# EAGLE schematic BeagleBone_Blue (EAGLE 8.0.1)

## Sheet 1 of 5
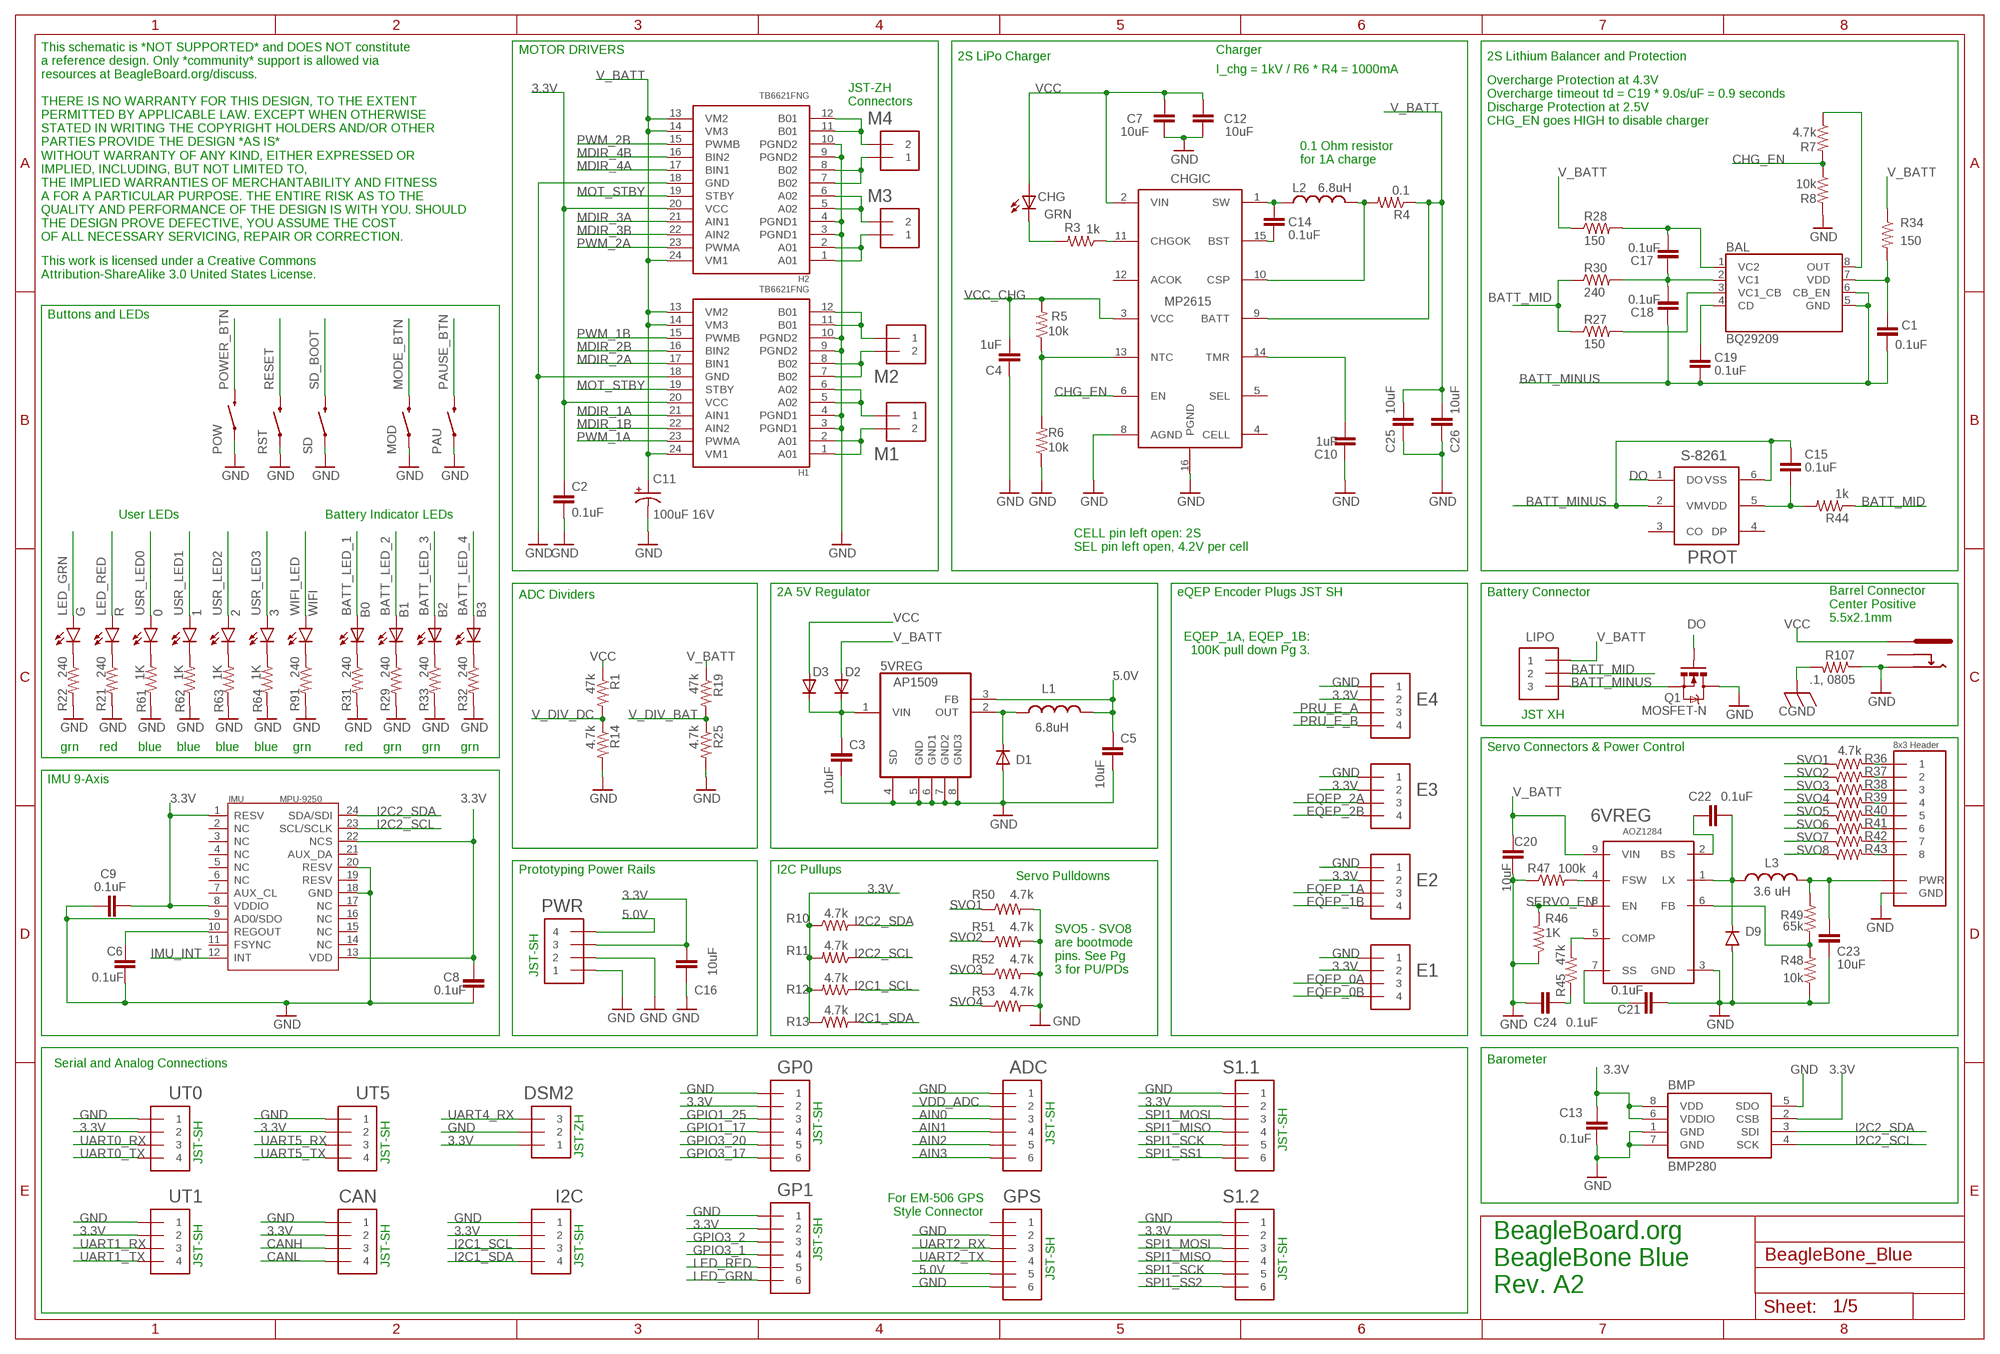
[diagram p0: schematic, sheet 1]

### Parts
0  BLUE  LED0603  [BEAGLEBONE_BLUE_LED-0603]
1  BLUE  LED0603  [BEAGLEBONE_BLUE_LED-0603]
2  BLUE  LED0603  [BEAGLEBONE_BLUE_LED-0603]
3  BLUE  LED0603  [BEAGLEBONE_BLUE_LED-0603]
5VREG  AP1509SOIC-8-TIGHT  [BEAGLEBONE_BLUE_SO08-TIGHT]
6VREG  AOZ1284  [SO08-EXPOSED]
12V  PJ-102B_POWER_CON  [PJ-102B_POWER_CON]
ADC  JST_SH_6  [JST_SH_6]
B0  RED  LED0603  [LED-0603]
B1  GREEN  LED0603  [LED-0603]
B2  GREEN  LED0603  [LED-0603]
B3  GREEN  LED0603  [LED-0603]
BAL  BQ29209  [8-SON_3X3MM]
BMP  BMP280  [BMP280]
C1  0.1uF  CAP0402-CAP  [0402-CAP]
C2  0.1uF  CAP0402-CAP  [0402-CAP]
C3  10uF  CAP0805  [0805]
C4  1uF  CAP0402-CAP  [0402-CAP]
C5  10uF  CAP0805  [0805]
C6  0.1uF  CAP0402-CAP  [0402-CAP]
C7  10uF  CAP0805  [0805]
C8  0.1uF  CAP0402-CAP  [0402-CAP]
C9  0.1uF  CAP0402-CAP  [0402-CAP]
C10  1uF  CAP0402-CAP  [0402-CAP]
C11  100uF 16V  CPOL-USD  [PANASONIC_D]
C12  10uF  CAP0805  [0805]
C13  0.1uF  CAP0402-CAP  [0402-CAP]
C14  0.1uF  CAP0402-CAP  [0402-CAP]
C15  0.1uF  CAP0402-CAP  [0402-CAP]
C16  10uF  CAP0805  [0805]
C17  0.1uF  CAP0402-CAP  [0402-CAP]
C18  0.1uF  CAP0402-CAP  [0402-CAP]
C19  0.1uF  CAP0402-CAP  [0402-CAP]
C20  10uF  CAP0805  [0805]
C21  0.1uF  CAP0402-CAP  [0402-CAP]
C22  0.1uF  CAP0402-CAP  [0402-CAP]
C23  10uF  CAP0805  [0805]
C24  0.1uF  CAP0402-CAP  [0402-CAP]
C25  10uF  CAP0805  [0805]
C26  10uF  CAP0805  [0805]
CAN  JST_SH_4  [JST_SH_4_SMD]
CHG  GRN  LED0603  [LED-0603]
CHGIC  MP2615  [MP2615]
D1  DIODE_SOD-123FL  [ADAFRUIT_SOD-123FL]
D2  DIODE_SOD-123FL  [ADAFRUIT_SOD-123FL]
D3  DIODE_SOD-123FL  [ADAFRUIT_SOD-123FL]
D9  DIODEDO214AA  [DO-214AA]
DSM2  JST_ZH_3  [JST_ZH_3]
E1  JST_SH_4  [JST_SH_4_SMD]
E2  JST_SH_4  [JST_SH_4_SMD]
E3  JST_SH_4  [JST_SH_4_SMD]
E4  JST_SH_4  [JST_SH_4_SMD]
G  GREEN  LED0603  [BEAGLEBONE_BLUE_LED-0603]
GP0  JST_SH_6  [JST_SH_6]
GP1  JST_SH_6  [JST_SH_6]
GPS  JST_SH_6  [JST_SH_6]
H1  TB6621FNG  [SSOP24]
H2  TB6621FNG  [SSOP24]
I2C  JST_SH_4  [JST_SH_4_SMD]
IMU  MPU-9250  [QFN24G-0.4-3X3MM]
J2  STRAWSON_EAGLE_LIB_SERVO_HEADERS_8X  [STRAWSON_EAGLE_LIB_3X8_0.1"_HEADER]
L1  6.8uH  INDUCTORBOURNS_SRN6045  [SRN6045]
L2  6.8uH  INDUCTORBOURNS_SRN6045  [SRN6045]
L3  3.6 uH  INDUCTOR  [8X8MM_INDUCTOR]
LIPO  BATTERY  JST_XH_3-PIN  [JST_XH_3-PIN]
M1  JST_ZH_2  [JST_ZH_2]
M2  JST_ZH_2  [JST_ZH_2]
M3  JST_ZH_2  [JST_ZH_2]
M4  JST_ZH_2  [JST_ZH_2]
MOD  SWITCH-MOMENTARY-2SMD-1101NE  [TACTILE-SWITCH-1101NE]
PAU  SWITCH-MOMENTARY-2SMD-1101NE  [TACTILE-SWITCH-1101NE]
POW  SWITCH-MOMENTARY-2SMD-1101NE  [TACTILE-SWITCH-1101NE]
PROT  S-8261  [SOT-236]
PWR  JST_SH_4  [JST_SH_4_SMD]
Q1  MOSFET-N  MOSFET-NCHANNEL  [SO08-TIGHT]
R  RED  LED0603  [BEAGLEBONE_BLUE_LED-0603]
R1  47k  RESISTOR0402-RES  [0402-RES]
R3  1k  RESISTOR0402-RES  [0402-RES]
R4  0.1  RESISTOR0603  [0603-RES]
R5  10k  RESISTOR0402-RES  [0402-RES]
R6  10k  RESISTOR0402-RES  [0402-RES]
R7  4.7k  RESISTOR0402-RES  [0402-RES]
R8  10k  RESISTOR0402-RES  [0402-RES]
R10  4.7k  RESISTOR0402-RES  [0402-RES]
R11  4.7k  RESISTOR0402-RES  [0402-RES]
R12  4.7k  RESISTOR0402-RES  [0402-RES]
R13  4.7k  RESISTOR0402-RES  [0402-RES]
R14  4.7k  RESISTOR0402-RES  [0402-RES]
R19  47k  RESISTOR0402-RES  [0402-RES]
R21  240  RESISTOR0402-RES  [0402-RES]
R22  240  RESISTOR0402-RES  [0402-RES]
R25  4.7k  RESISTOR0402-RES  [0402-RES]
R27  150  RESISTOR0402-RES  [0402-RES]
R28  150  RESISTOR0402-RES  [0402-RES]
R29  240  RESISTOR0402-RES  [0402-RES]
R30  240  RESISTOR0402-RES  [0402-RES]
R31  240  RESISTOR0402-RES  [0402-RES]
R32  240  RESISTOR0402-RES  [0402-RES]
R33  240  RESISTOR0402-RES  [0402-RES]
R34  150  RESISTOR0402-RES  [0402-RES]
R36  4.7k  RESISTOR0402-RES  [0402-RES]
R37  4.7k  RESISTOR0402-RES  [0402-RES]
R38  4.7k  RESISTOR0402-RES  [0402-RES]
R39  4.7k  RESISTOR0402-RES  [0402-RES]
R40  4.7k  RESISTOR0402-RES  [0402-RES]
R41  4.7k  RESISTOR0402-RES  [0402-RES]
R42  4.7k  RESISTOR0402-RES  [0402-RES]
R43  4.7k  RESISTOR0402-RES  [0402-RES]
R44  1k  RESISTOR0402-RES  [0402-RES]
R45  47k  RESISTOR0402-RES  [0402-RES]
R46  1K  RESISTOR0402-RES  [0402-RES]
R47  100k  RESISTOR0402-RES  [0402-RES]
R48  10k  RESISTOR0402-RES  [0402-RES]
R49  65k  RESISTOR0402-RES  [0402-RES]
R50  4.7k  RESISTOR0402-RES  [0402-RES]
R51  4.7k  RESISTOR0402-RES  [0402-RES]
R52  4.7k  RESISTOR0402-RES  [0402-RES]
R53  4.7k  RESISTOR0402-RES  [0402-RES]
R61  1K  RESISTOR0402-RES  [0402-RES]
R62  1K  RESISTOR0402-RES  [0402-RES]
R63  1K  RESISTOR0402-RES  [0402-RES]
R64  1K  RESISTOR0402-RES  [0402-RES]
R91  240  RESISTOR0402-RES  [0402-RES]
R107  .1, 0805  R-US_R0805  [R0805]
RST  SWITCH-MOMENTARY-2SMD-1101NE  [TACTILE-SWITCH-1101NE]
S1.1  JST_SH_6  [JST_SH_6]
S1.2  JST_SH_6  [JST_SH_6]
SD  SWITCH-MOMENTARY-2SMD-1101NE  [TACTILE-SWITCH-1101NE]
UT0  JST_SH_4  [JST_SH_4_SMD]
UT1  JST_SH_4  [JST_SH_4_SMD]
UT5  JST_SH_4  [JST_SH_4_SMD]
WIFI  GREEN  LED0603  [BEAGLEBONE_BLUE_LED-0603]

### Nets
3.3V: BMP.2(CSB) BMP.6(VDDIO) BMP.8(VDD) C2.2 C8.1 C9.2 C13.1 C16.1 CAN.2 DSM2.P$1 E1.2 E2.2 E3.2 E4.2 GP0.2 GP1.2 H1.20(VCC) H2.20(VCC) I2C.2 IMU.1(RESV) IMU.8(VDDIO) IMU.13(VDD) IMU.22(NCS) PWR.3 R10.1 R11.2 R12.2 R13.1 S1.1.2 S1.2.2 UT0.2 UT1.2 UT5.2 ; also sheet 2,3,5
5.0V [power]: 5VREG.3(FB) C5.1 GPS.5 L1.2 PWR.4 ; also sheet 2,3
AIN0: ADC.3 ; also sheet 3
AIN1: ADC.4 ; also sheet 3
AIN2: ADC.5 ; also sheet 3
AIN3: ADC.6 ; also sheet 3
BATT_LED_1: B0.A ; also sheet 2
BATT_LED_2: B1.A ; also sheet 3
BATT_LED_3: B2.A ; also sheet 2
BATT_LED_4: B3.A ; also sheet 2
BATT_MID: LIPO.P$2 R27.1 R30.1 R44.1
BATT_MINUS: BAL.5(GND) BAL.6(CB_EN) C1.2 C15.1 C18.1 C19.2 LIPO.P$3 PROT.2(VM) PROT.6(VSS) Q1.1(S) Q1.2(S) Q1.3(S)
CANH: CAN.3 ; also sheet 2
CANL: CAN.4 ; also sheet 2
CGND: R107.2 ; also sheet 2,3,4
CHG_EN: CHGIC.6(EN) R7.2 R8.1
CO: BAL.8(OUT) R7.1
DO: PROT.1(DO) Q1.4(G)
EQEP_0A: E1.3 ; also sheet 2
EQEP_0B: E1.4 ; also sheet 2
EQEP_1A: E2.3 ; also sheet 3
EQEP_1B: E2.4 ; also sheet 3
EQEP_2A: E3.3 ; also sheet 2
EQEP_2B: E3.4 ; also sheet 2
GND [ground]: 5VREG.4(SD) 5VREG.5(GND) 5VREG.6(GND1) 5VREG.7(GND2) 5VREG.8(GND3) 6VREG.3(GND) 12V.OUT ADC.1 BMP.1(GND) BMP.5(SDO) BMP.7(GND) C2.1 C3.2 C4.1 C5.2 C6.2 C7.2 C8.2 C9.1 C10.1 C11.- C12.2 C13.2 C16.2 C20.1 C21.1 C23.1 C24.1 C25.2 C26.2 CAN.1 CHGIC.8(AGND) CHGIC.16(PGND) D1.A D9.A DSM2.P$2 E1.1 E2.1 E3.1 E4.1 GP0.1 GP1.1 GPS.2 GPS.6 H1.3(PGND1) H1.4(PGND1) H1.9(PGND2) H1.10(PGND2) H1.18(GND) H2.3(PGND1) H2.4(PGND1) H2.9(PGND2) H2.10(PGND2) H2.18(GND) I2C.1 IMU.9(AD0/SDO) IMU.18(GND) IMU.20(RESV) J2.P$13(GND) J2.P$14(GND) J2.P$15(GND) J2.P$16(GND) J2.P$17(GND) J2.P$18(GND) J2.P$23(GND) J2.P$24(GND) MOD.1 PAU.1 POW.1 PWR.1 PWR.2 Q1.5(D) Q1.6(D) Q1.7(D) Q1.8(D) R6.1 R8.2 R14.2 R21.2 R22.2 R25.2 R29.2 R31.2 R32.2 R33.2 R46.1 R47.1 R48.1 R50.2 R51.2 R52.2 R53.2 R61.1 R62.1 R63.1 R64.1 R91.2 R107.1 RST.1 S1.1.1 S1.2.1 SD.1 UT0.1 UT1.1 UT5.1 ; also sheet 2,3,4,5
GPIO1_17: GP0.4 ; also sheet 2
GPIO1_25: GP0.3 ; also sheet 3
GPIO3_1: GP1.4 ; also sheet 3
GPIO3_2: GP1.3 ; also sheet 3
GPIO3_17: GP0.6 ; also sheet 2
GPIO3_20: GP0.5 ; also sheet 2
I2C1_SCL: I2C.3 R12.1 ; also sheet 2
I2C1_SDA: I2C.4 R13.2 ; also sheet 2
I2C2_SCL: BMP.4(SCK) IMU.23(SCL/SCLK) R11.1 ; also sheet 2
I2C2_SDA: BMP.3(SDI) IMU.24(SDA/SDI) R10.2 ; also sheet 2
IMU_INT: IMU.12(INT) ; also sheet 2
L3: B2.C R33.1
L4: B3.C R32.1
LED_GRN: G.A GP1.6 ; also sheet 2
LED_RED: GP1.5 R.A ; also sheet 2
MDIR_1A: H1.21(AIN1) ; also sheet 2
MDIR_1B: H1.22(AIN2) ; also sheet 2
MDIR_2A: H1.17(BIN1) ; also sheet 2
MDIR_2B: H1.16(BIN2) ; also sheet 3
MDIR_3A: H2.21(AIN1) ; also sheet 3
MDIR_3B: H2.22(AIN2) ; also sheet 3
MDIR_4A: H2.17(BIN1) ; also sheet 3
MDIR_4B: H2.16(BIN2) ; also sheet 3
MODE_BTN: MOD.2 ; also sheet 2
MOT1A: H1.1(A01) H1.2(A01) M1.P$2
MOT1B: H1.5(A02) H1.6(A02) M1.P$1
MOT2A: H1.11(B01) H1.12(B01) M2.P$1
MOT2B: H1.7(B02) H1.8(B02) M2.P$2
MOT3A: H2.1(A01) H2.2(A01) M3.P$1
MOT3B: H2.5(A02) H2.6(A02) M3.P$2
MOT4A: H2.11(B01) H2.12(B01) M4.P$2
MOT4B: H2.7(B02) H2.8(B02) M4.P$1
MOT_STBY: H1.19(STBY) H2.19(STBY) ; also sheet 2
N$1: J2.P$1 R36.2
N$3: G.C R22.1
N$4: BAL.2(VC1) C17.1 C18.2 R30.2
N$6: R21.1 R.C
N$8: BAL.1(VC2) C17.2 R28.2
N$10: 6VREG.7(SS) C21.2
N$11: C15.2 PROT.5(VDD) R44.2
N$14: C6.1 IMU.10(REGOUT)
N$15: C14.1 CHGIC.15(BST)
N$16: 5VREG.2(OUT) D1.C L1.1
N$17: CHG.C R3.2
N$18: CHGIC.11(CHGOK) R3.1
N$20: R91.1 WIFI.C
N$24: BAL.4(CD) C19.1
N$25: J2.P$2 R37.2
N$29: BAL.7(VDD) C1.1 R34.2
N$30: J2.P$3 R38.2
N$38: J2.P$4 R39.2
N$47: 0.C R61.2
N$48: B1.C R29.1
N$49: B0.C R31.1
N$50: BAL.3(VC1_CB) R27.2
N$51: J2.P$5 R40.2
N$52: J2.P$6 R41.2
N$53: 6VREG.2(BS) C22.1
N$54: J2.P$19 R42.2
N$55: C14.2 CHGIC.1(SW) L2.1
N$56: J2.P$20 R43.2
N$57: 1.C R62.2
N$58: 2.C R63.2
N$59: 3.C R64.2
N$60: 6VREG.1(LX) C22.2 D9.C L3.1
N$61: 6VREG.4(FSW) R47.2
N$62: C23.2 J2.P$7(PWR) J2.P$8(PWR) J2.P$9(PWR) J2.P$10(PWR) J2.P$11(PWR) J2.P$12(PWR) J2.P$21(PWR) J2.P$22(PWR) L3.2 R49.2
N$63: 6VREG.5(COMP) R45.2
N$65: 6VREG.6(FB) R48.2 R49.1
N$66: C24.2 R45.1
N$67: CHGIC.10(CSP) L2.2 R4.2
N$69: C10.2 CHGIC.14(TMR)
N$71: CHGIC.13(NTC) R5.1 R6.2
N$79: 5VREG.1(VIN) C3.1 D2.C D3.C
PAUSE_BTN: PAU.2 ; also sheet 2
POWER_BTN: POW.2 ; also sheet 2
PRU_E_A: E4.3 ; also sheet 2
PRU_E_B: E4.4 ; also sheet 2
PWM_1A: H1.23(PWMA) ; also sheet 2
PWM_1B: H1.15(PWMB) ; also sheet 2
PWM_2A: H2.23(PWMA) ; also sheet 2
PWM_2B: H2.15(PWMB) ; also sheet 2
RESET: RST.2 ; also sheet 2
SD_BOOT: SD.2 ; also sheet 3
SERVO_EN: 6VREG.8(EN) R46.2 ; also sheet 3
SPI1_MISO: S1.1.4 S1.2.4 ; also sheet 2
SPI1_MOSI: S1.1.3 S1.2.3 ; also sheet 2
SPI1_SCK: S1.1.5 S1.2.5 ; also sheet 2
SPI1_SS1: S1.1.6 ; also sheet 3
SPI1_SS2: S1.2.6 ; also sheet 2
SVO1: R36.1 R50.1 ; also sheet 3
SVO2: R37.1 R51.1 ; also sheet 3
SVO3: R38.1 R52.1 ; also sheet 3
SVO4: R39.1 R53.1 ; also sheet 3
SVO5: R40.1 ; also sheet 3
SVO6: R41.1 ; also sheet 3
SVO7: R42.1 ; also sheet 3
SVO8: R43.1 ; also sheet 3
UART0_RX: UT0.3 ; also sheet 2
UART0_TX: UT0.4 ; also sheet 2
UART1_RX: UT1.3 ; also sheet 2
UART1_TX: UT1.4 ; also sheet 2
UART2_RX: GPS.3 ; also sheet 2
UART2_TX: GPS.4 ; also sheet 2
UART4_RX: DSM2.P$3 ; also sheet 2
UART5_RX: UT5.3 ; also sheet 3
UART5_TX: UT5.4 ; also sheet 3
USR_LED0: 0.A ; also sheet 2
USR_LED1: 1.A ; also sheet 2
USR_LED2: 2.A ; also sheet 2
USR_LED3: 3.A ; also sheet 2
V_BATT: 6VREG.9(VIN) C11.+ C20.2 C25.1 C26.1 CHGIC.9(BATT) D2.A H1.13(VM2) H1.14(VM3) H1.24(VM1) H2.13(VM2) H2.14(VM3) H2.24(VM1) LIPO.P$1 R4.1 R19.1 R28.1 R34.1
V_DIV_BAT: R19.2 R25.1 ; also sheet 3
V_DIV_DC: R1.2 R14.1 ; also sheet 3
VCC: 12V.IN C7.1 C12.1 CHG.A CHGIC.2(VIN) D3.A R1.1
VCC_CHG: C4.2 CHGIC.3(VCC) R5.2
VDD_ADC: ADC.2 ; also sheet 3,4
WIFI_LED: WIFI.A ; also sheet 2
Unconnected: 12V.OUT_CON CHGIC.4(CELL) CHGIC.5(SEL) CHGIC.12(ACOK) GPS.1 IMU.2(NC) IMU.3(NC) IMU.4(NC) IMU.5(NC) IMU.6(NC) IMU.7(AUX_CL) IMU.11(FSYNC) IMU.14(NC) IMU.15(NC) IMU.16(NC) IMU.17(NC) IMU.19(RESV) IMU.21(AUX_DA) PROT.3(CO) PROT.4(DP)

### Notes on the sheet
- MOTOR DRIVERS | Charger
- 2S LiPo Charger | 2S Lithium Balancer and Protection
- I_chg = 1kV / R6 * R4 = 1000mA
- JST-ZH
  Connectors
- Overcharge Protection at 4.3V
  Overcharge timeout td = C19 * 9.0s/uF = 0.9 seconds
  Discharge Protection at 2.5V
  CHG_EN goes HIGH to disable charger
- 0.1 Ohm resistor
  for 1A charge
- This schematic is *NOT SUPPORTED* and DOES NOT constitute 
  a reference design. Only *community* support is allowed via 
  resources at BeagleBoard.org/discuss. 
  
  THERE IS NO WARRANTY FOR THIS DESIGN, TO THE EXTENT 
  PERMITTED BY APPLICABLE LAW. EXCEPT WHEN OTHERWISE 
  STATED IN WRITING THE COPYRIGHT HOLDERS AND/OR OTHER 
  PARTIES PROVIDE THE DESIGN *AS IS*
  WITHOUT WARRANTY OF ANY KIND, EITHER EXPRESSED OR 
  IMPLIED, INCLUDING, BUT NOT LIMITED TO, 
  THE IMPLIED WARRANTIES OF MERCHANTABILITY AND FITNESS 
  A FOR A PARTICULAR PURPOSE. THE ENTIRE RISK AS TO THE 
  QUALITY AND PERFORMANCE OF THE DESIGN IS WITH YOU. SHOULD 
  THE DESIGN PROVE DEFECTIVE, YOU ASSUME THE COST 
  OF ALL NECESSARY SERVICING, REPAIR OR CORRECTION.
- This work is licensed under a Creative Commons 
  Attribution-ShareAlike 3.0 United States License.
- Buttons and LEDs
- User LEDs | Battery Indicator LEDs
- CELL pin left open: 2S
  SEL pin left open, 4.2V per cell
- ADC Dividers
- 2A 5V Regulator | eQEP Encoder Plugs JST SH | Battery Connector
- Barrel Connector
  Center Positive
  5.5x2.1mm
- EQEP_1A, EQEP_1B: 
    100K pull down Pg 3.
- JST XH
- grn | red | blue | blue | blue | blue | grn | red | grn | grn | grn | Servo Connectors & Power Control
- IMU 9-Axis
- Prototyping Power Rails | I2C Pullups
- Servo Pulldowns
- SVO5 - SVO8 
  are bootmode 
  pins. See Pg 
  3 for PU/PDs
- JST-SH
- Barometer
- Serial and Analog Connections
- JST-SH | JST-SH
- JST-SH
- JST-ZH
- JST-SH | JST-SH
- For EM-506 GPS
  Style Connector
- JST-SH
- JST-SH | JST-SH | JST-SH
- JST-SH | JST-SH
- BeagleBoard.org
  BeagleBone Blue
  Rev. A2

## Sheet 2 of 5
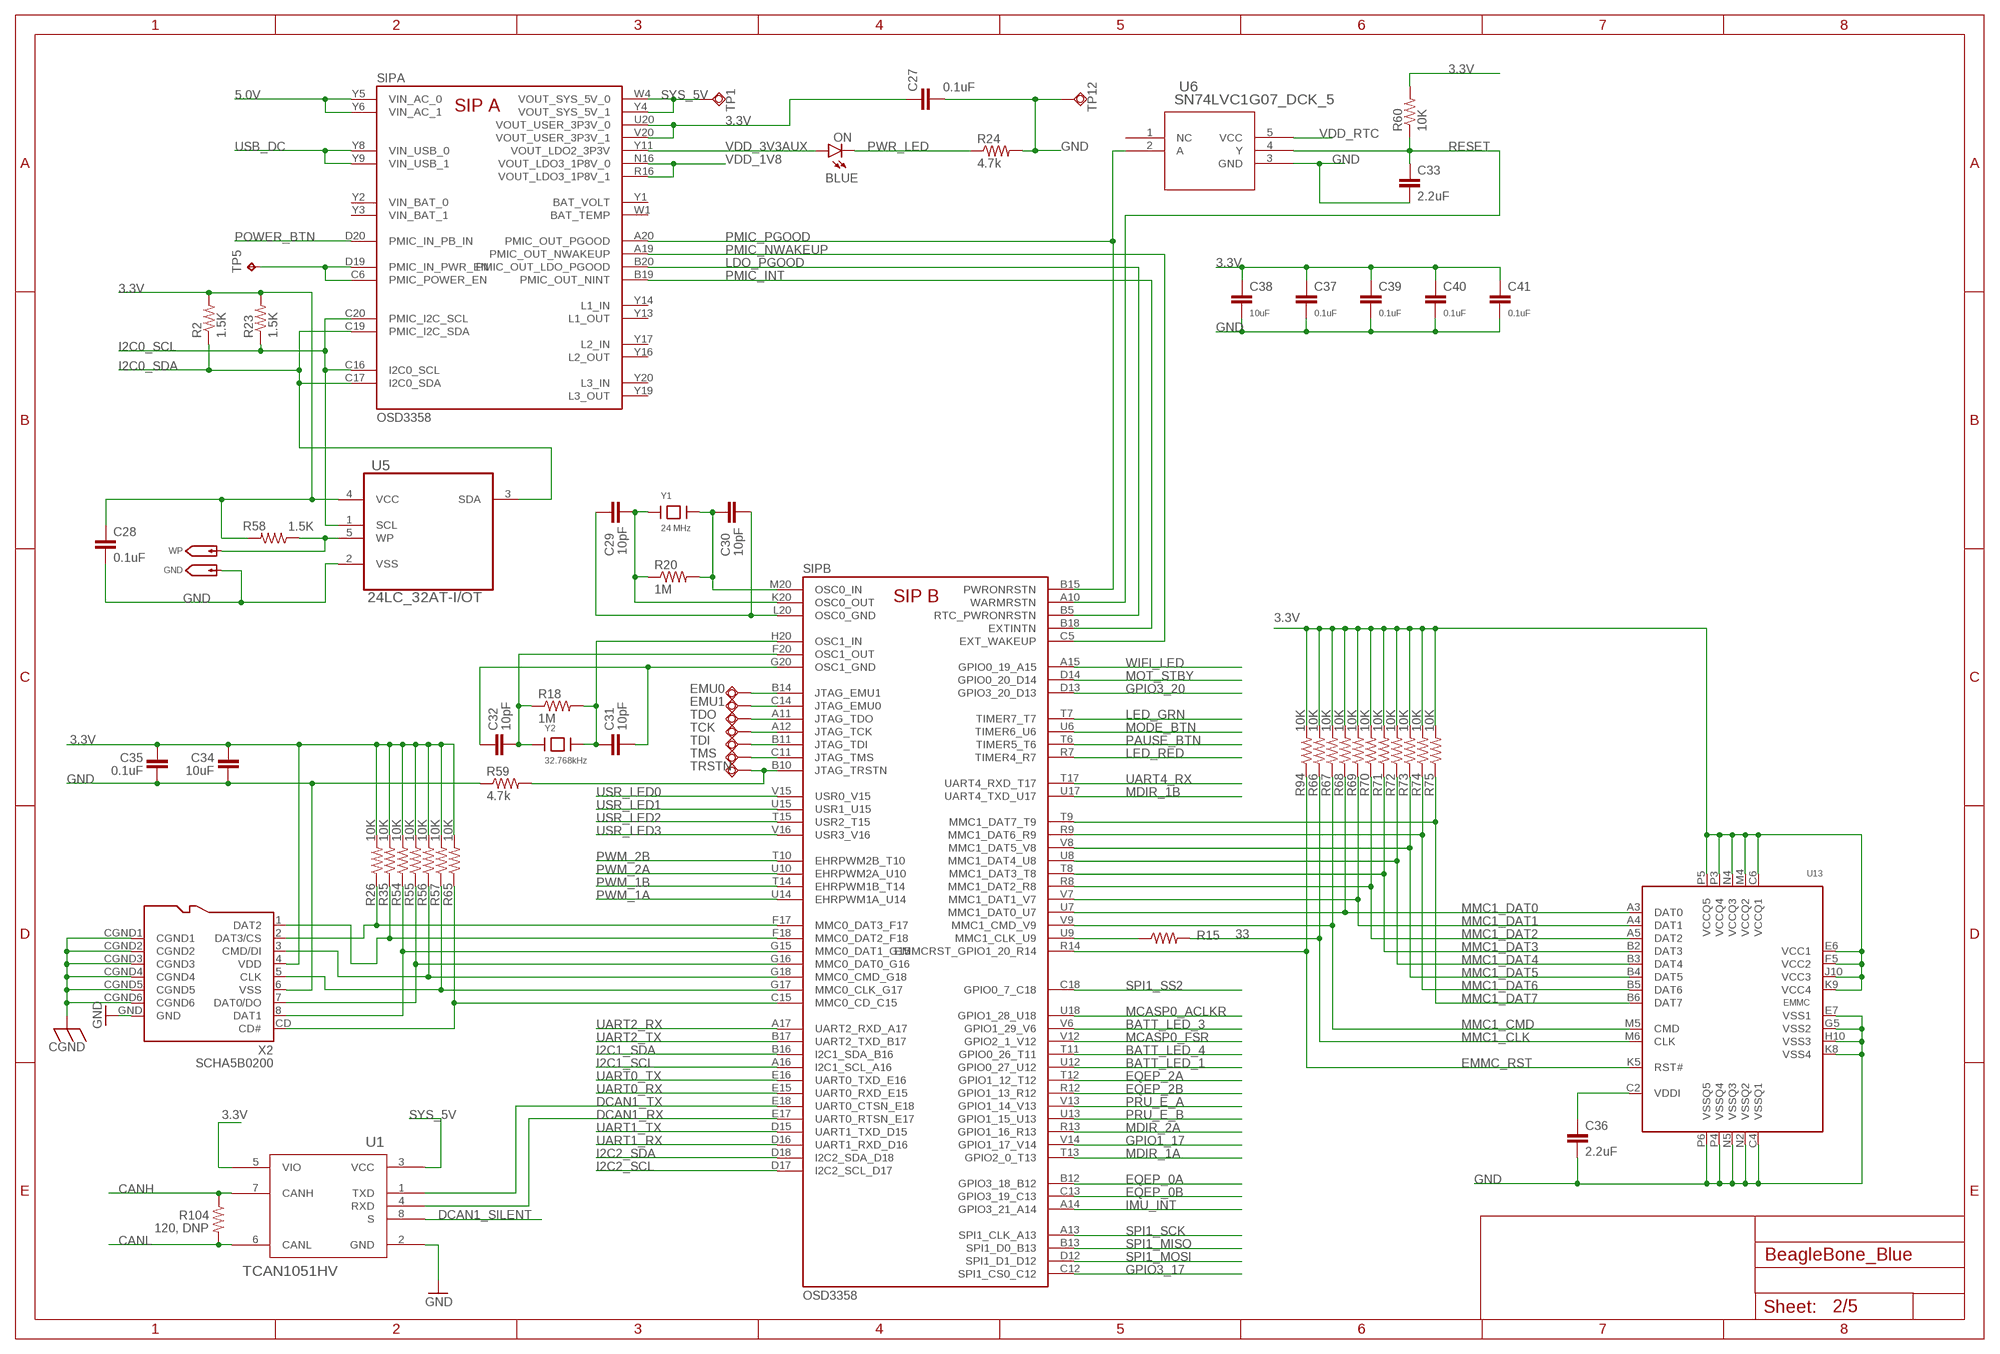
[diagram p1: schematic, sheet 2]

### Parts
C27  0.1uF  CAP0402-CAP  [0402-CAP]
C28  0.1uF  CAP0402-CAP  [0402-CAP]
C29  10pF  CAP0402-CAP  [0402-CAP]
C30  10pF  CAP0402-CAP  [0402-CAP]
C31  10pF  CAP0402-CAP  [0402-CAP]
C32  10pF  CAP0402-CAP  [0402-CAP]
C33  2.2uF  CAP0402-CAP  [0402-CAP]
C34  10uF  CAP0805  [0805]
C35  0.1uF  CAP0402-CAP  [0402-CAP]
C36  2.2uF  CAP0402-CAP  [0402-CAP]
C37  0.1uF  CAP0402-CAP  [0402-CAP]
C38  10uF  CAP0805  [0805]
C39  0.1uF  CAP0402-CAP  [0402-CAP]
C40  0.1uF  CAP0402-CAP  [0402-CAP]
C41  0.1uF  CAP0402-CAP  [0402-CAP]
EMU0  TPSQB1,27  [B1,27]
EMU1  TPSQB1,27  [B1,27]
GND  GHI2_TESTPAD/W_HOLE_1X1  [GHI2_TESTPAD/W_HOLE_1X1]
ON  BLUE  LED0603  [BEAGLEBONE_BLUE_LED-0603]
R2  1.5K  RESISTOR0402-RES  [0402-RES]
R15  33  RESISTOR0402-RES  [0402-RES]
R18  1M  RESISTOR0402-RES  [0402-RES]
R20  1M  RESISTOR0402-RES  [0402-RES]
R23  1.5K  RESISTOR0402-RES  [0402-RES]
R24  4.7k  RESISTOR0402-RES  [0402-RES]
R26  10K  RESISTOR0402-RES  [0402-RES]
R35  10K  RESISTOR0402-RES  [0402-RES]
R54  10K  RESISTOR0402-RES  [0402-RES]
R55  10K  RESISTOR0402-RES  [0402-RES]
R56  10K  RESISTOR0402-RES  [0402-RES]
R57  10K  RESISTOR0402-RES  [0402-RES]
R58  1.5K  RESISTOR0402-RES  [0402-RES]
R59  4.7k  RESISTOR0402-RES  [0402-RES]
R60  10K  RESISTOR0402-RES  [0402-RES]
R65  10K  RESISTOR0402-RES  [0402-RES]
R66  10K  RESISTOR0402-RES  [0402-RES]
R67  10K  RESISTOR0402-RES  [0402-RES]
R68  10K  RESISTOR0402-RES  [0402-RES]
R69  10K  RESISTOR0402-RES  [0402-RES]
R70  10K  RESISTOR0402-RES  [0402-RES]
R71  10K  RESISTOR0402-RES  [0402-RES]
R72  10K  RESISTOR0402-RES  [0402-RES]
R73  10K  RESISTOR0402-RES  [0402-RES]
R74  10K  RESISTOR0402-RES  [0402-RES]
R75  10K  RESISTOR0402-RES  [0402-RES]
R94  10K  RESISTOR0402-RES  [0402-RES]
R104  120, DNP  RESISTOR0603  [0603-RES]
SIP  OSD3358  [BEAGLEBONE_BLUE_OSD3358]
TCK  TPSQB1,27  [B1,27]
TDI  TPSQB1,27  [B1,27]
TDO  TPSQB1,27  [B1,27]
TMS  TPSQB1,27  [B1,27]
TP1  TPSQB1,27  [B1,27]
TP5  TPB0,65  [BEAGLEBONE_BLUE_B0,65]
TP12  TPSQB1,27  [B1,27]
TRSTN  TPSQB1,27  [B1,27]
U1  TCAN1051HV  [BEAGLEBONE_BLUE_D8]
U5  24LC_32AT-I/OT  [SOT95P290X145-5N]
U6  SN74LVC1G07_DCK_5  [BEAGLEBONE_BLUE_DCK5]
U13  EMMC  EMMC04G-S100-B08U  [MICRON_EMMC_153]
WP  GHI2_TESTPAD/W_HOLE_1X1  [GHI2_TESTPAD/W_HOLE_1X1]
X2  SCHA5B0200  SCHA5B0200(ALPS_USD)  [SCHA5B0200]
Y1  24 MHz  CRYSTAL_5X3.2MM  [CRYSTAL_5X3.2MM]
Y2  32.768kHz  CRYSTAL_3.2X1.5  [CRYSTAL_3.2X1.5]

### Nets
3.3V: C27.1 C28.1 C34.2 C35.2 C37.1 C38.1 C39.1 C40.1 C41.1 R2.2 R23.2 R26.2 R35.2 R54.2 R55.2 R56.2 R57.2 R58.2 R60.2 R65.2 R66.2 R67.2 R68.2 R69.2 R70.2 R71.2 R72.2 R73.2 R74.2 R75.2 R94.2 SIP.U20(A:VOUT_USER_3P3V_0) SIP.V20(A:VOUT_USER_3P3V_1) U1.5(VIO) U5.4(VCC) U13.C6(VCCQ1) U13.E6(VCC1) U13.F5(VCC2) U13.J10(VCC3) U13.K9(VCC4) U13.M4(VCCQ2) U13.N4(VCCQ3) U13.P3(VCCQ4) U13.P5(VCCQ5) X2.4(VDD) ; also sheet 1,3,5
5.0V [power]: SIP.Y5(A:VIN_AC_0) SIP.Y6(A:VIN_AC_1) ; also sheet 1,3
BATT_LED_1: SIP.U12(B:GPIO0_27_U12) ; also sheet 1
BATT_LED_3: SIP.V6(B:GPIO1_29_V6) ; also sheet 1
BATT_LED_4: SIP.T11(B:GPIO0_26_T11) ; also sheet 1
CANH: R104.1 U1.7(CANH) ; also sheet 1
CANL: R104.2 U1.6(CANL) ; also sheet 1
CGND: X2.CGND1 X2.CGND2 X2.CGND3 X2.CGND4 X2.CGND5 X2.CGND6 ; also sheet 1,3,4
DCAN1_RX: SIP.E17(B:UART0_RTSN_E17) U1.4(RXD)
DCAN1_SILENT: U1.8(S) ; also sheet 3
DCAN1_TX: SIP.E18(B:UART0_CTSN_E18) U1.1(TXD)
EMMC_RST: R94.1 SIP.R14(B:EMMCRST_GPIO1_20_R14) U13.K5(RST#)
EQEP_0A: SIP.B12(B:GPIO3_18_B12) ; also sheet 1
EQEP_0B: SIP.C13(B:GPIO3_19_C13) ; also sheet 1
EQEP_2A: SIP.T12(B:GPIO1_12_T12) ; also sheet 1
EQEP_2B: SIP.R12(B:GPIO1_13_R12) ; also sheet 1
GND [ground]: C27.2 C28.2 C33.2 C34.1 C35.1 C36.2 C37.2 C38.2 C39.2 C40.2 C41.2 GND.P$1(TP) R24.2 R59.1 TP12.TP U1.2(GND) U5.2(VSS) U6.3(GND) U13.C4(VSSQ1) U13.E7(VSS1) U13.G5(VSS2) U13.H10(VSS3) U13.K8(VSS4) U13.N2(VSSQ2) U13.N5(VSSQ3) U13.P4(VSSQ4) U13.P6(VSSQ5) X2.6(VSS) X2.GND ; also sheet 1,3,4,5
GPIO1_17: SIP.V14(B:GPIO1_17_V14) ; also sheet 1
GPIO3_17: SIP.C12(B:SPI1_CS0_C12) ; also sheet 1
GPIO3_20: SIP.D13(B:GPIO3_20_D13) ; also sheet 1
I2C0_SCL: R23.1 SIP.C16(A:I2C0_SCL) SIP.C20(A:PMIC_I2C_SCL) U5.1(SCL)
I2C0_SDA: R2.1 SIP.C17(A:I2C0_SDA) SIP.C19(A:PMIC_I2C_SDA) U5.3(SDA)
I2C1_SCL: SIP.A16(B:I2C1_SCL_A16) ; also sheet 1
I2C1_SDA: SIP.B16(B:I2C1_SDA_B16) ; also sheet 1
I2C2_SCL: SIP.D17(B:I2C2_SCL_D17) ; also sheet 1
I2C2_SDA: SIP.D18(B:I2C2_SDA_D18) ; also sheet 1
IMU_INT: SIP.A14(B:GPIO3_21_A14) ; also sheet 1
LDO_PGOOD: SIP.B5(B:RTC_PWRONRSTN) SIP.B20(A:PMIC_OUT_LDO_PGOOD)
LED_GRN: SIP.T7(B:TIMER7_T7) ; also sheet 1
LED_RED: SIP.R7(B:TIMER4_R7) ; also sheet 1
MCASP0_ACLKR: SIP.U18(B:GPIO1_28_U18) ; also sheet 5
MCASP0_FSR: SIP.V12(B:GPIO2_1_V12) ; also sheet 5
MDIR_1A: SIP.T13(B:GPIO2_0_T13) ; also sheet 1
MDIR_1B: SIP.U17(B:UART4_TXD_U17) ; also sheet 1
MDIR_2A: SIP.R13(B:GPIO1_16_R13) ; also sheet 1
MMC1_CLK: R15.2 R66.1 U13.M6(CLK)
MMC1_CMD: R67.1 SIP.V9(B:MMC1_CMD_V9) U13.M5(CMD)
MMC1_DAT0: R68.1 SIP.U7(B:MMC1_DAT0_U7) U13.A3(DAT0)
MMC1_DAT1: R69.1 SIP.V7(B:MMC1_DAT1_V7) U13.A4(DAT1)
MMC1_DAT2: R70.1 SIP.R8(B:MMC1_DAT2_R8) U13.A5(DAT2)
MMC1_DAT3: R71.1 SIP.T8(B:MMC1_DAT3_T8) U13.B2(DAT3)
MMC1_DAT4: R72.1 SIP.U8(B:MMC1_DAT4_U8) U13.B3(DAT4)
MMC1_DAT5: R73.1 SIP.V8(B:MMC1_DAT5_V8) U13.B4(DAT5)
MMC1_DAT6: R74.1 SIP.R9(B:MMC1_DAT6_R9) U13.B5(DAT6)
MMC1_DAT7: R75.1 SIP.T9(B:MMC1_DAT7_T9) U13.B6(DAT7)
MODE_BTN: SIP.U6(B:TIMER6_U6) ; also sheet 1
MOT_STBY: SIP.D14(B:GPIO0_20_D14) ; also sheet 1
N$2: R57.1 SIP.G17(B:MMC0_CLK_G17) X2.5(CLK)
N$5: R26.1 SIP.F17(B:MMC0_DAT3_F17) X2.2(DAT3/CS)
N$12: SIP.C6(A:PMIC_POWER_EN) SIP.D19(A:PMIC_IN_PWR_EN) TP5.TP
N$26: C30.1 R20.2 SIP.M20(B:OSC0_IN) Y1.2
N$27: C29.1 R20.1 SIP.K20(B:OSC0_OUT) Y1.1
N$28: R58.1 U5.5(WP) WP.P$1(TP)
N$31: C29.2 C30.2 SIP.L20(B:OSC0_GND)
N$32: C31.1 R18.2 SIP.H20(B:OSC1_IN) Y2.P$2
N$33: C32.2 R18.1 SIP.F20(B:OSC1_OUT) Y2.P$1
N$34: C31.2 C32.1 SIP.G20(B:OSC1_GND)
N$35: EMU0.TP SIP.B14(B:JTAG_EMU1)
N$36: EMU1.TP SIP.C14(B:JTAG_EMU0)
N$37: SIP.A11(B:JTAG_TDO) TDO.TP
N$39: SIP.A12(B:JTAG_TCK) TCK.TP
N$40: SIP.B11(B:JTAG_TDI) TDI.TP
N$41: SIP.C11(B:JTAG_TMS) TMS.TP
N$42: R59.2 SIP.B10(B:JTAG_TRSTN) TRSTN.TP
N$70: R54.1 SIP.G15(B:MMC0_DAT1_G15) X2.8(DAT1)
N$74: R56.1 SIP.G18(B:MMC0_CMD_G18) X2.3(CMD/DI)
N$75: R65.1 SIP.C15(B:MMC0_CD_C15) X2.CD(CD#)
N$77: R55.1 SIP.G16(B:MMC0_DAT0_G16) X2.7(DAT0/DO)
N$81: C36.1 U13.C2(VDDI)
N$85: R15.1 SIP.U9(B:MMC1_CLK_U9)
NTE: R35.1 SIP.F18(B:MMC0_DAT2_F18) X2.1(DAT2)
PAUSE_BTN: SIP.T6(B:TIMER5_T6) ; also sheet 1
PMIC_INT: SIP.B18(B:EXTINTN) SIP.B19(A:PMIC_OUT_NINT)
PMIC_NWAKEUP: SIP.A19(A:PMIC_OUT_NWAKEUP) SIP.C5(B:EXT_WAKEUP)
PMIC_PGOOD: SIP.A20(A:PMIC_OUT_PGOOD) SIP.B15(B:PWRONRSTN) U6.2(A)
POWER_BTN: SIP.D20(A:PMIC_IN_PB_IN) ; also sheet 1
PRU_E_A: SIP.V13(B:GPIO1_14_V13) ; also sheet 1
PRU_E_B: SIP.U13(B:GPIO1_15_U13) ; also sheet 1
PWM_1A: SIP.U14(B:EHRPWM1A_U14) ; also sheet 1
PWM_1B: SIP.T14(B:EHRPWM1B_T14) ; also sheet 1
PWM_2A: SIP.U10(B:EHRPWM2A_U10) ; also sheet 1
PWM_2B: SIP.T10(B:EHRPWM2B_T10) ; also sheet 1
PWR_LED: ON.C R24.1
RESET: C33.1 R60.1 SIP.A10(B:WARMRSTN) U6.4(Y) ; also sheet 1
SPI1_MISO: SIP.B13(B:SPI1_D0_B13) ; also sheet 1
SPI1_MOSI: SIP.D12(B:SPI1_D1_D12) ; also sheet 1
SPI1_SCK: SIP.A13(B:SPI1_CLK_A13) ; also sheet 1
SPI1_SS2: SIP.C18(B:GPIO0_7_C18) ; also sheet 1
SYS_5V [power]: SIP.W4(A:VOUT_SYS_5V_0) SIP.Y4(A:VOUT_SYS_5V_1) TP1.TP U1.3(VCC) ; also sheet 3
UART0_RX: SIP.E15(B:UART0_RXD_E15) ; also sheet 1
UART0_TX: SIP.E16(B:UART0_TXD_E16) ; also sheet 1
UART1_RX: SIP.D16(B:UART1_RXD_D16) ; also sheet 1
UART1_TX: SIP.D15(B:UART1_TXD_D15) ; also sheet 1
UART2_RX: SIP.A17(B:UART2_RXD_A17) ; also sheet 1
UART2_TX: SIP.B17(B:UART2_TXD_B17) ; also sheet 1
UART4_RX: SIP.T17(B:UART4_RXD_T17) ; also sheet 1
USB_DC [power]: SIP.Y8(A:VIN_USB_0) SIP.Y9(A:VIN_USB_1) ; also sheet 3
USR_LED0: SIP.V15(B:USR0_V15) ; also sheet 1
USR_LED1: SIP.U15(B:USR1_U15) ; also sheet 1
USR_LED2: SIP.T15(B:USR2_T15) ; also sheet 1
USR_LED3: SIP.V16(B:USR3_V16) ; also sheet 1
VDD_1V8: SIP.N16(A:VOUT_LDO3_1P8V_0) SIP.R16(A:VOUT_LDO3_1P8V_1) ; also sheet 4,5
VDD_3V3AUX: ON.A SIP.Y11(A:VOUT_LDO2_3P3V)
VDD_RTC: U6.5(VCC) ; also sheet 4
WIFI_LED: SIP.A15(B:GPIO0_19_A15) ; also sheet 1
Unconnected: SIP.W1(A:BAT_TEMP) SIP.Y1(A:BAT_VOLT) SIP.Y13(A:L1_OUT) SIP.Y14(A:L1_IN) SIP.Y16(A:L2_OUT) SIP.Y17(A:L2_IN) SIP.Y19(A:L3_OUT) SIP.Y20(A:L3_IN) U6.1(NC)

## Sheet 3 of 5
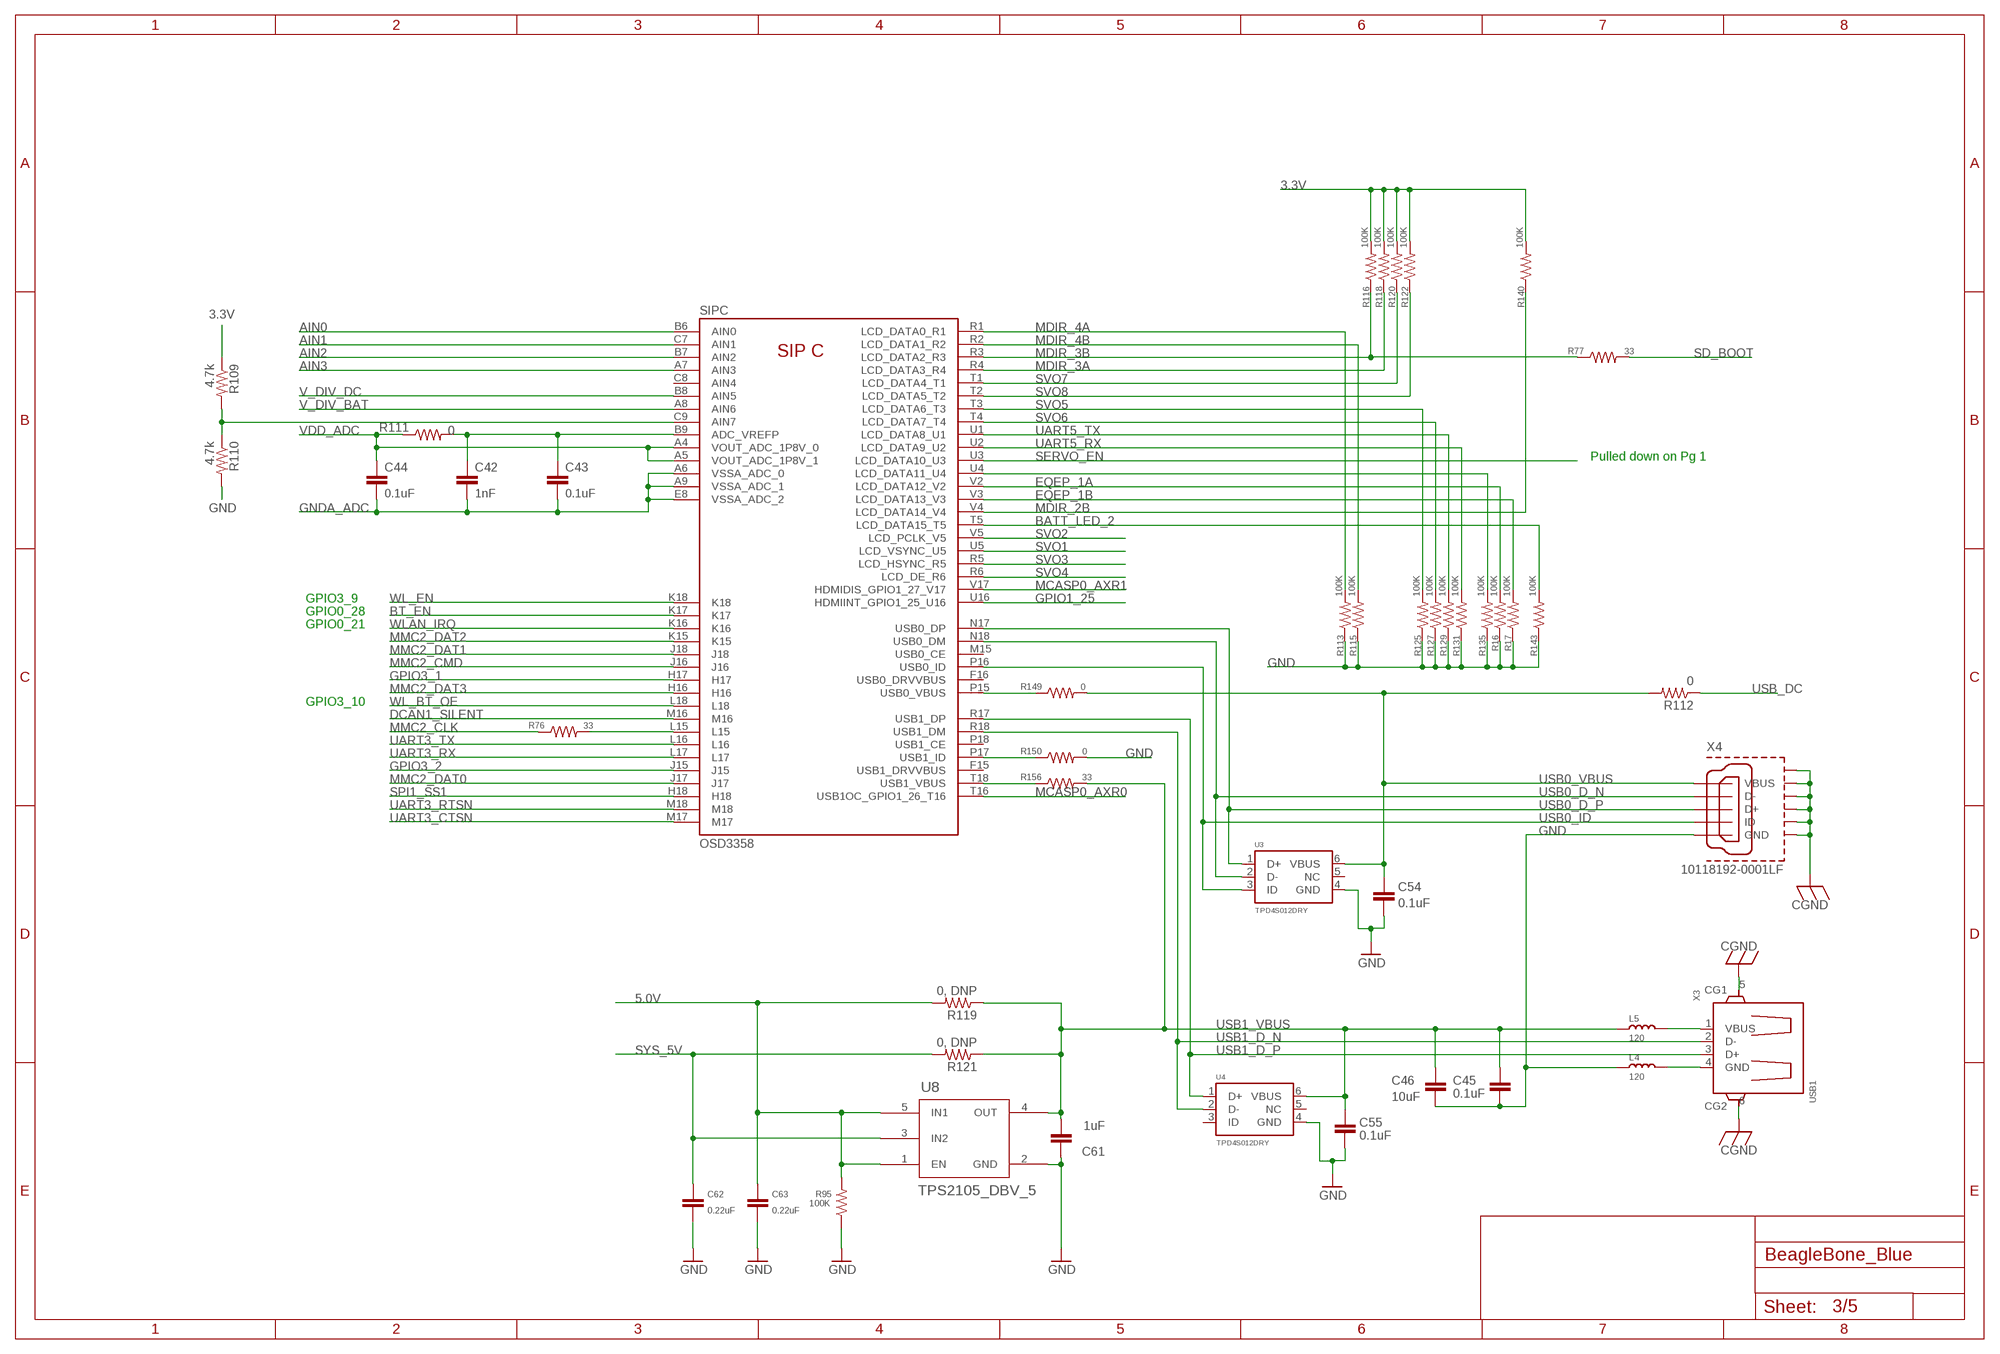
[diagram p2: schematic, sheet 3]

### Parts
C42  1nF  CAP0402-CAP  [0402-CAP]
C43  0.1uF  CAP0402-CAP  [0402-CAP]
C44  0.1uF  CAP0402-CAP  [0402-CAP]
C45  0.1uF  CAP0402-CAP  [0402-CAP]
C46  10uF  CAP0805  [0805]
C54  0.1uF  CAP0402-CAP  [0402-CAP]
C55  0.1uF  CAP0402-CAP  [0402-CAP]
C61  1uF  CAP0402-CAP  [0402-CAP]
C62  0.22uF  CAP0402-CAP  [0402-CAP]
C63  0.22uF  CAP0402-CAP  [0402-CAP]
L4  120  INDUCTOR/FERRITE-BEAD'0603'  [L0603]
L5  120  INDUCTOR/FERRITE-BEAD'0603'  [L0603]
R16  100K  RESISTOR0402-RES  [0402-RES]
R17  100K  RESISTOR0402-RES  [0402-RES]
R76  33  RESISTOR0402-RES  [0402-RES]
R77  33  RESISTOR0402-RES  [0402-RES]
R95  100K  RESISTOR0402-RES  [0402-RES]
R109  4.7k  RESISTOR0402-RES  [0402-RES]
R110  4.7k  RESISTOR0402-RES  [0402-RES]
R111  0  RESISTOR0402-RES  [0402-RES]
R112  0  RESISTOR0603  [0603-RES]
R113  100K  RESISTOR0402-RES  [0402-RES]
R115  100K  RESISTOR0402-RES  [0402-RES]
R116  100K  RESISTOR0402-RES  [0402-RES]
R118  100K  RESISTOR0402-RES  [0402-RES]
R119  0, DNP  RESISTOR0603  [0603-RES]
R120  100K  RESISTOR0402-RES  [0402-RES]
R121  0, DNP  RESISTOR0603  [0603-RES]
R122  100K  RESISTOR0402-RES  [0402-RES]
R125  100K  RESISTOR0402-RES  [0402-RES]
R127  100K  RESISTOR0402-RES  [0402-RES]
R129  100K  RESISTOR0402-RES  [0402-RES]
R131  100K  RESISTOR0402-RES  [0402-RES]
R135  100K  RESISTOR0402-RES  [0402-RES]
R140  100K  RESISTOR0402-RES  [0402-RES]
R143  100K  RESISTOR0402-RES  [0402-RES]
R149  0  RESISTOR0402-RES  [0402-RES]
R150  0  RESISTOR0402-RES  [0402-RES]
R156  33  RESISTOR0402-RES  [0402-RES]
U3  TPD4S012DRY  TPD4S012DRYR  [SON-6(TI)-DRY]
U4  TPD4S012DRY  TPD4S012DRYR  [SON-6(TI)-DRY]
U8  TPS2105_DBV_5  [DBV5]
X3  USB1  USB_HOST_W/CHASSIS_GND  [USB_HOST_HORIZONTAL_W/CHASSIS_GND]
X4  10118192-0001LF  [10118192-0001LF(MICRO-USB-B-AMPHENOL-FCI)]

### Nets
3.3V: R109.1 R116.2 R118.2 R120.2 R122.2 R140.2 ; also sheet 1,2,5
5.0V [power]: C63.1 R95.2 R119.2 U8.1(EN) U8.5(IN1) ; also sheet 1,2
AIN0: SIP.B6(C:AIN0) ; also sheet 1
AIN1: SIP.C7(C:AIN1) ; also sheet 1
AIN2: SIP.B7(C:AIN2) ; also sheet 1
AIN3: SIP.A7(C:AIN3) ; also sheet 1
BATT_LED_2: R143.2 SIP.T5(C:LCD_DATA15_T5) ; also sheet 1
BT_EN: SIP.K17(C:K17) ; also sheet 5
CGND: X3.5(CG1) X3.6(CG2) X4.CGND1(SGND1) X4.CGND2(SGND2) X4.CGND3(SGND3) X4.CGND4(SGND4) X4.CGND5(SGND5) X4.CGND6(SGND6) ; also sheet 1,2,4
DCAN1_SILENT: SIP.M16(C:M16) ; also sheet 2
EQEP_1A: R16.2 SIP.V2(C:LCD_DATA12_V2) ; also sheet 1
EQEP_1B: R17.2 SIP.V3(C:LCD_DATA13_V3) ; also sheet 1
GND [ground]: C45.2 C46.2 C54.2 C55.2 C61.1 C62.2 C63.2 L4.1 R16.1 R17.1 R95.1 R110.2 R113.1 R115.1 R125.1 R127.1 R129.1 R131.1 R135.1 R143.1 R150.2 U3.4(GND) U4.4(GND) U8.2(GND) X4.GND ; also sheet 1,2,4,5
GNDA_ADC: C42.2 C43.2 C44.2 SIP.A6(C:VSSA_ADC_0) SIP.A9(C:VSSA_ADC_1) SIP.E8(C:VSSA_ADC_2)
GPIO1_25: SIP.U16(C:HDMIINT_GPIO1_25_U16) ; also sheet 1
GPIO3_1: SIP.H17(C:H17) ; also sheet 1
GPIO3_2: SIP.J15(C:J15) ; also sheet 1
MCASP0_AXR0: SIP.T16(C:USB1OC_GPIO1_26_T16) ; also sheet 5
MCASP0_AXR1: SIP.V17(C:HDMIDIS_GPIO1_27_V17) ; also sheet 5
MDIR_2B: R140.1 SIP.V4(C:LCD_DATA14_V4) ; also sheet 1
MDIR_3A: R118.1 SIP.R4(C:LCD_DATA3_R4) ; also sheet 1
MDIR_3B: R77.1 R116.1 SIP.R3(C:LCD_DATA2_R3) ; also sheet 1
MDIR_4A: R113.2 SIP.R1(C:LCD_DATA0_R1) ; also sheet 1
MDIR_4B: R115.2 SIP.R2(C:LCD_DATA1_R2) ; also sheet 1
MMC2_CLK: R76.1 ; also sheet 5
MMC2_CMD: SIP.J16(C:J16) ; also sheet 5
MMC2_DAT0: SIP.J17(C:J17) ; also sheet 5
MMC2_DAT1: SIP.J18(C:J18) ; also sheet 5
MMC2_DAT2: SIP.K15(C:K15) ; also sheet 5
MMC2_DAT3: SIP.H16(C:H16) ; also sheet 5
N$45: R76.2 SIP.L15(C:L15)
N$86: R135.2 SIP.U4(C:LCD_DATA11_U4)
N$110: C42.1 C43.1 R111.2 SIP.B9(C:ADC_VREFP)
N$115: R109.2 R110.1 SIP.C9(C:AIN7)
N$121: R149.1 SIP.P15(C:USB0_VBUS)
N$126: R150.1 SIP.P17(C:USB1_ID)
N$128 [power]: L4.2 X3.4(GND)
N$129: R156.1 SIP.T18(C:USB1_VBUS)
N$130 [power]: L5.2 X3.1(VBUS)
SD_BOOT: R77.2 ; also sheet 1
SERVO_EN: SIP.U3(C:LCD_DATA10_U3) ; also sheet 1
SPI1_SS1: SIP.H18(C:H18) ; also sheet 1
SVO1: SIP.U5(C:LCD_VSYNC_U5) ; also sheet 1
SVO2: SIP.V5(C:LCD_PCLK_V5) ; also sheet 1
SVO3: SIP.R5(C:LCD_HSYNC_R5) ; also sheet 1
SVO4: SIP.R6(C:LCD_DE_R6) ; also sheet 1
SVO5: R125.2 SIP.T3(C:LCD_DATA6_T3) ; also sheet 1
SVO6: R127.2 SIP.T4(C:LCD_DATA7_T4) ; also sheet 1
SVO7: R120.1 SIP.T1(C:LCD_DATA4_T1) ; also sheet 1
SVO8: R122.1 SIP.T2(C:LCD_DATA5_T2) ; also sheet 1
SYS_5V [power]: C62.1 R121.2 U8.3(IN2) ; also sheet 2
UART3_CTSN: SIP.M17(C:M17) ; also sheet 5
UART3_RTSN: SIP.M18(C:M18) ; also sheet 5
UART3_RX: SIP.L17(C:L17) ; also sheet 5
UART3_TX: SIP.L16(C:L16) ; also sheet 5
UART5_RX: R131.2 SIP.U2(C:LCD_DATA9_U2) ; also sheet 1
UART5_TX: R129.2 SIP.U1(C:LCD_DATA8_U1) ; also sheet 1
USB0_D_N: SIP.N18(C:USB0_DM) U3.2(D-) X4.D-
USB0_D_P: SIP.N17(C:USB0_DP) U3.1(D+) X4.D+
USB0_ID: SIP.P16(C:USB0_ID) U3.3(ID) X4.ID
USB0_VBUS: C54.1 R112.2 R149.2 U3.6(VBUS) X4.VBUS
USB1_D_N: SIP.R18(C:USB1_DM) U4.2(D-) X3.2(D-)
USB1_D_P: SIP.R17(C:USB1_DP) U4.1(D+) X3.3(D+)
USB1_VBUS: C45.1 C46.1 C55.1 C61.2 L5.1 R119.1 R121.1 R156.2 U4.6(VBUS) U8.4(OUT)
USB_DC [power]: R112.1 ; also sheet 2
V_DIV_BAT: SIP.A8(C:AIN6) ; also sheet 1
V_DIV_DC: SIP.B8(C:AIN5) ; also sheet 1
VDD_ADC: C44.1 R111.1 SIP.A4(C:VOUT_ADC_1P8V_0) SIP.A5(C:VOUT_ADC_1P8V_1) ; also sheet 1,4
WL_BT_OE: SIP.L18(C:L18) ; also sheet 5
WL_EN: SIP.K18(C:K18) ; also sheet 5
WLAN_IRQ: SIP.K16(C:K16) ; also sheet 5
Unconnected: SIP.C8(C:AIN4) SIP.F15(C:USB1_DRVVBUS) SIP.F16(C:USB0_DRVVBUS) SIP.M15(C:USB0_CE) SIP.P18(C:USB1_CE) U3.5(NC) U4.3(ID) U4.5(NC)

### Notes on the sheet
- Pulled down on Pg 1
- GPIO3_9
- GPIO0_28
- GPIO0_21
- GPIO3_10

## Sheet 4 of 5
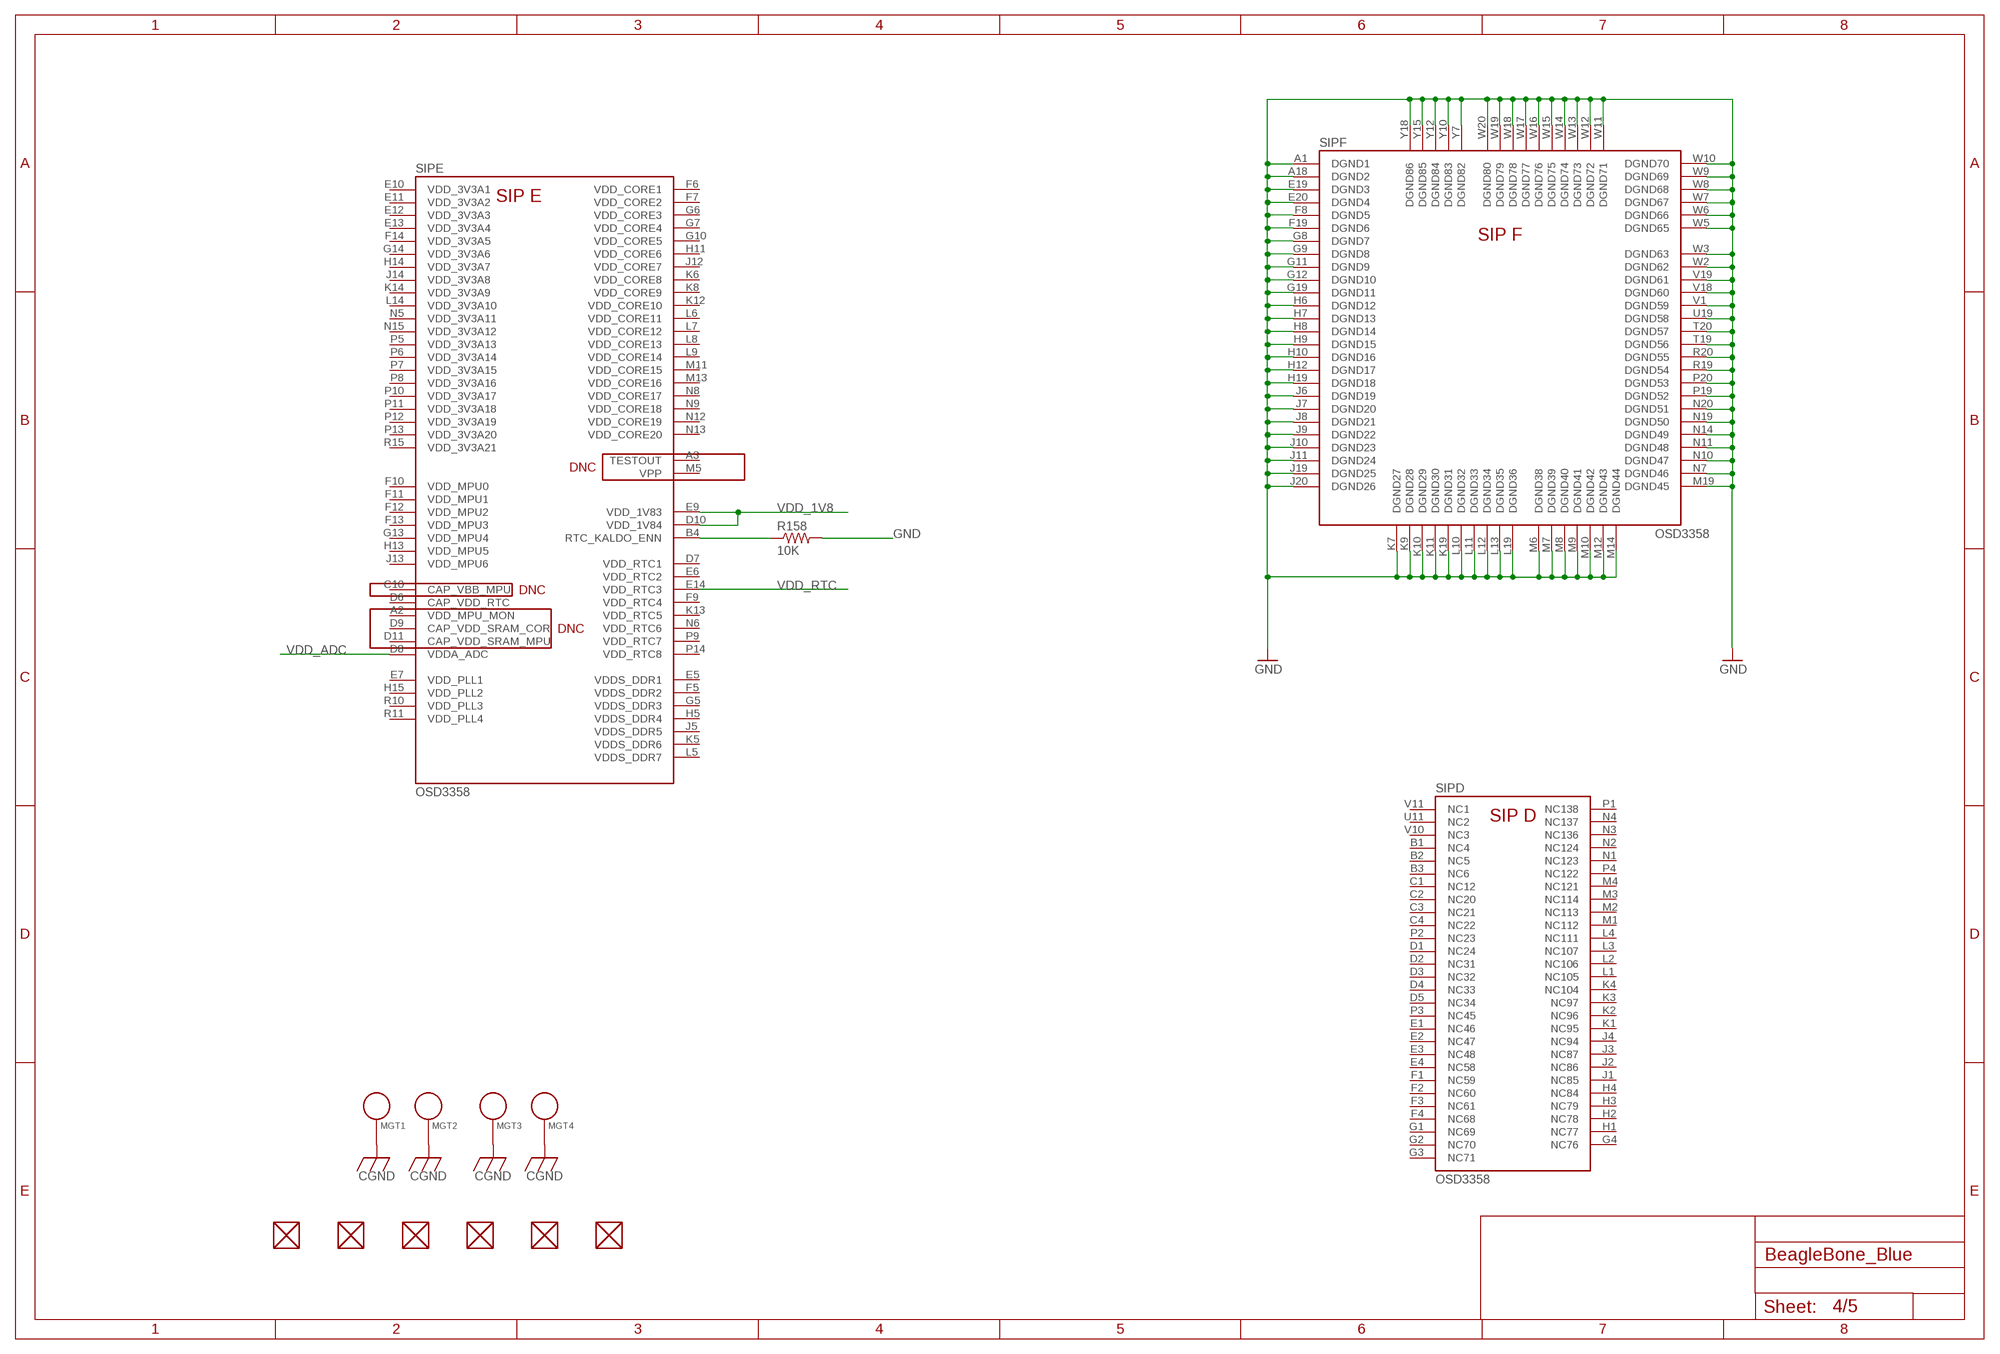
[diagram p3: schematic, sheet 4]

### Parts
FUD1  FIDUCIAL  [FIDUCIAL_40MIL]
FUD2  FIDUCIAL  [FIDUCIAL_40MIL]
FUD3  FIDUCIAL  [FIDUCIAL_40MIL]
FUD4  FIDUCIAL  [FIDUCIAL_40MIL]
FUD5  FIDUCIAL  [FIDUCIAL_40MIL]
FUD6  FIDUCIAL  [FIDUCIAL_40MIL]
MGT1  MOUNTING_HOLE  [MOUNTING_HOLE]
MGT2  MOUNTING_HOLE  [MOUNTING_HOLE]
MGT3  MOUNTING_HOLE  [MOUNTING_HOLE]
MGT4  MOUNTING_HOLE  [MOUNTING_HOLE]
R158  10K  RESISTOR0402-RES  [0402-RES]

### Nets
CGND: MGT1.P$1 MGT2.P$1 MGT3.P$1 MGT4.P$1 ; also sheet 1,2,3
GND [ground]: R158.2 SIP.A1(F:DGND1) SIP.A18(F:DGND2) SIP.E19(F:DGND3) SIP.E20(F:DGND4) SIP.F8(F:DGND5) SIP.F19(F:DGND6) SIP.G8(F:DGND7) SIP.G9(F:DGND8) SIP.G11(F:DGND9) SIP.G12(F:DGND10) SIP.G19(F:DGND11) SIP.H6(F:DGND12) SIP.H7(F:DGND13) SIP.H8(F:DGND14) SIP.H9(F:DGND15) SIP.H10(F:DGND16) SIP.H12(F:DGND17) SIP.H19(F:DGND18) SIP.J6(F:DGND19) SIP.J7(F:DGND20) SIP.J8(F:DGND21) SIP.J9(F:DGND22) SIP.J10(F:DGND23) SIP.J11(F:DGND24) SIP.J19(F:DGND25) SIP.J20(F:DGND26) SIP.K7(F:DGND27) SIP.K9(F:DGND28) SIP.K10(F:DGND29) SIP.K11(F:DGND30) SIP.K19(F:DGND31) SIP.L10(F:DGND32) SIP.L11(F:DGND33) SIP.L12(F:DGND34) SIP.L13(F:DGND35) SIP.L19(F:DGND36) SIP.M6(F:DGND38) SIP.M7(F:DGND39) SIP.M8(F:DGND40) SIP.M9(F:DGND41) SIP.M10(F:DGND42) SIP.M12(F:DGND43) SIP.M14(F:DGND44) SIP.M19(F:DGND45) SIP.N7(F:DGND46) SIP.N10(F:DGND47) SIP.N11(F:DGND48) SIP.N14(F:DGND49) SIP.N19(F:DGND50) SIP.N20(F:DGND51) SIP.P19(F:DGND52) SIP.P20(F:DGND53) SIP.R19(F:DGND54) SIP.R20(F:DGND55) SIP.T19(F:DGND56) SIP.T20(F:DGND57) SIP.U19(F:DGND58) SIP.V1(F:DGND59) SIP.V18(F:DGND60) SIP.V19(F:DGND61) SIP.W2(F:DGND62) SIP.W3(F:DGND63) SIP.W5(F:DGND65) SIP.W6(F:DGND66) SIP.W7(F:DGND67) SIP.W8(F:DGND68) SIP.W9(F:DGND69) SIP.W10(F:DGND70) SIP.W11(F:DGND71) SIP.W12(F:DGND72) SIP.W13(F:DGND73) SIP.W14(F:DGND74) SIP.W15(F:DGND75) SIP.W16(F:DGND76) SIP.W17(F:DGND77) SIP.W18(F:DGND78) SIP.W19(F:DGND79) SIP.W20(F:DGND80) SIP.Y7(F:DGND82) SIP.Y10(F:DGND83) SIP.Y12(F:DGND84) SIP.Y15(F:DGND85) SIP.Y18(F:DGND86) ; also sheet 1,2,3,5
N$131: R158.1 SIP.B4(E:RTC_KALDO_ENN)
VDD_1V8: SIP.D10(E:VDD_1V84) SIP.E9(E:VDD_1V83) ; also sheet 2,5
VDD_ADC: SIP.D8(E:VDDA_ADC) ; also sheet 1,3
VDD_RTC: SIP.E14(E:VDD_RTC3) ; also sheet 2
Unconnected: FUD1.P$1 FUD2.P$1 FUD3.P$1 FUD4.P$1 FUD5.P$1 FUD6.P$1 SIP.A2(E:VDD_MPU_MON) SIP.A3(E:TESTOUT) SIP.B1(D:NC4) SIP.B2(D:NC5) SIP.B3(D:NC6) SIP.C1(D:NC12) SIP.C2(D:NC20) SIP.C3(D:NC21) SIP.C4(D:NC22) SIP.C10(E:CAP_VBB_MPU) SIP.D1(D:NC24) SIP.D2(D:NC31) SIP.D3(D:NC32) SIP.D4(D:NC33) SIP.D5(D:NC34) SIP.D6(E:CAP_VDD_RTC) SIP.D7(E:VDD_RTC1) SIP.D9(E:CAP_VDD_SRAM_COR) SIP.D11(E:CAP_VDD_SRAM_MPU) SIP.E1(D:NC46) SIP.E2(D:NC47) SIP.E3(D:NC48) SIP.E4(D:NC58) SIP.E5(E:VDDS_DDR1) SIP.E6(E:VDD_RTC2) SIP.E7(E:VDD_PLL1) SIP.E10(E:VDD_3V3A1) SIP.E11(E:VDD_3V3A2) SIP.E12(E:VDD_3V3A3) SIP.E13(E:VDD_3V3A4) SIP.F1(D:NC59) SIP.F2(D:NC60) SIP.F3(D:NC61) SIP.F4(D:NC68) SIP.F5(E:VDDS_DDR2) SIP.F6(E:VDD_CORE1) SIP.F7(E:VDD_CORE2) SIP.F9(E:VDD_RTC4) SIP.F10(E:VDD_MPU0) SIP.F11(E:VDD_MPU1) SIP.F12(E:VDD_MPU2) SIP.F13(E:VDD_MPU3) SIP.F14(E:VDD_3V3A5) SIP.G1(D:NC69) SIP.G2(D:NC70) SIP.G3(D:NC71) SIP.G4(D:NC76) SIP.G5(E:VDDS_DDR3) SIP.G6(E:VDD_CORE3) SIP.G7(E:VDD_CORE4) SIP.G10(E:VDD_CORE5) SIP.G13(E:VDD_MPU4) SIP.G14(E:VDD_3V3A6) SIP.H1(D:NC77) SIP.H2(D:NC78) SIP.H3(D:NC79) SIP.H4(D:NC84) SIP.H5(E:VDDS_DDR4) SIP.H11(E:VDD_CORE6) SIP.H13(E:VDD_MPU5) SIP.H14(E:VDD_3V3A7) SIP.H15(E:VDD_PLL2) SIP.J1(D:NC85) SIP.J2(D:NC86) SIP.J3(D:NC87) SIP.J4(D:NC94) SIP.J5(E:VDDS_DDR5) SIP.J12(E:VDD_CORE7) SIP.J13(E:VDD_MPU6) SIP.J14(E:VDD_3V3A8) SIP.K1(D:NC95) SIP.K2(D:NC96) SIP.K3(D:NC97) SIP.K4(D:NC104) SIP.K5(E:VDDS_DDR6) SIP.K6(E:VDD_CORE8) SIP.K8(E:VDD_CORE9) SIP.K12(E:VDD_CORE10) SIP.K13(E:VDD_RTC5) SIP.K14(E:VDD_3V3A9) SIP.L1(D:NC105) SIP.L2(D:NC106) SIP.L3(D:NC107) SIP.L4(D:NC111) SIP.L5(E:VDDS_DDR7) SIP.L6(E:VDD_CORE11) SIP.L7(E:VDD_CORE12) SIP.L8(E:VDD_CORE13) SIP.L9(E:VDD_CORE14) SIP.L14(E:VDD_3V3A10) SIP.M1(D:NC112) SIP.M2(D:NC113) SIP.M3(D:NC114) SIP.M4(D:NC121) SIP.M5(E:VPP) SIP.M11(E:VDD_CORE15) SIP.M13(E:VDD_CORE16) SIP.N1(D:NC123) SIP.N2(D:NC124) SIP.N3(D:NC136) SIP.N4(D:NC137) SIP.N5(E:VDD_3V3A11) SIP.N6(E:VDD_RTC6) SIP.N8(E:VDD_CORE17) SIP.N9(E:VDD_CORE18) SIP.N12(E:VDD_CORE19) SIP.N13(E:VDD_CORE20) SIP.N15(E:VDD_3V3A12) SIP.P1(D:NC138) SIP.P2(D:NC23) SIP.P3(D:NC45) SIP.P4(D:NC122) SIP.P5(E:VDD_3V3A13) SIP.P6(E:VDD_3V3A14) SIP.P7(E:VDD_3V3A15) SIP.P8(E:VDD_3V3A16) SIP.P9(E:VDD_RTC7) SIP.P10(E:VDD_3V3A17) SIP.P11(E:VDD_3V3A18) SIP.P12(E:VDD_3V3A19) SIP.P13(E:VDD_3V3A20) SIP.P14(E:VDD_RTC8) SIP.R10(E:VDD_PLL3) SIP.R11(E:VDD_PLL4) SIP.R15(E:VDD_3V3A21) SIP.U11(D:NC2) SIP.V10(D:NC3) SIP.V11(D:NC1)

## Sheet 5 of 5
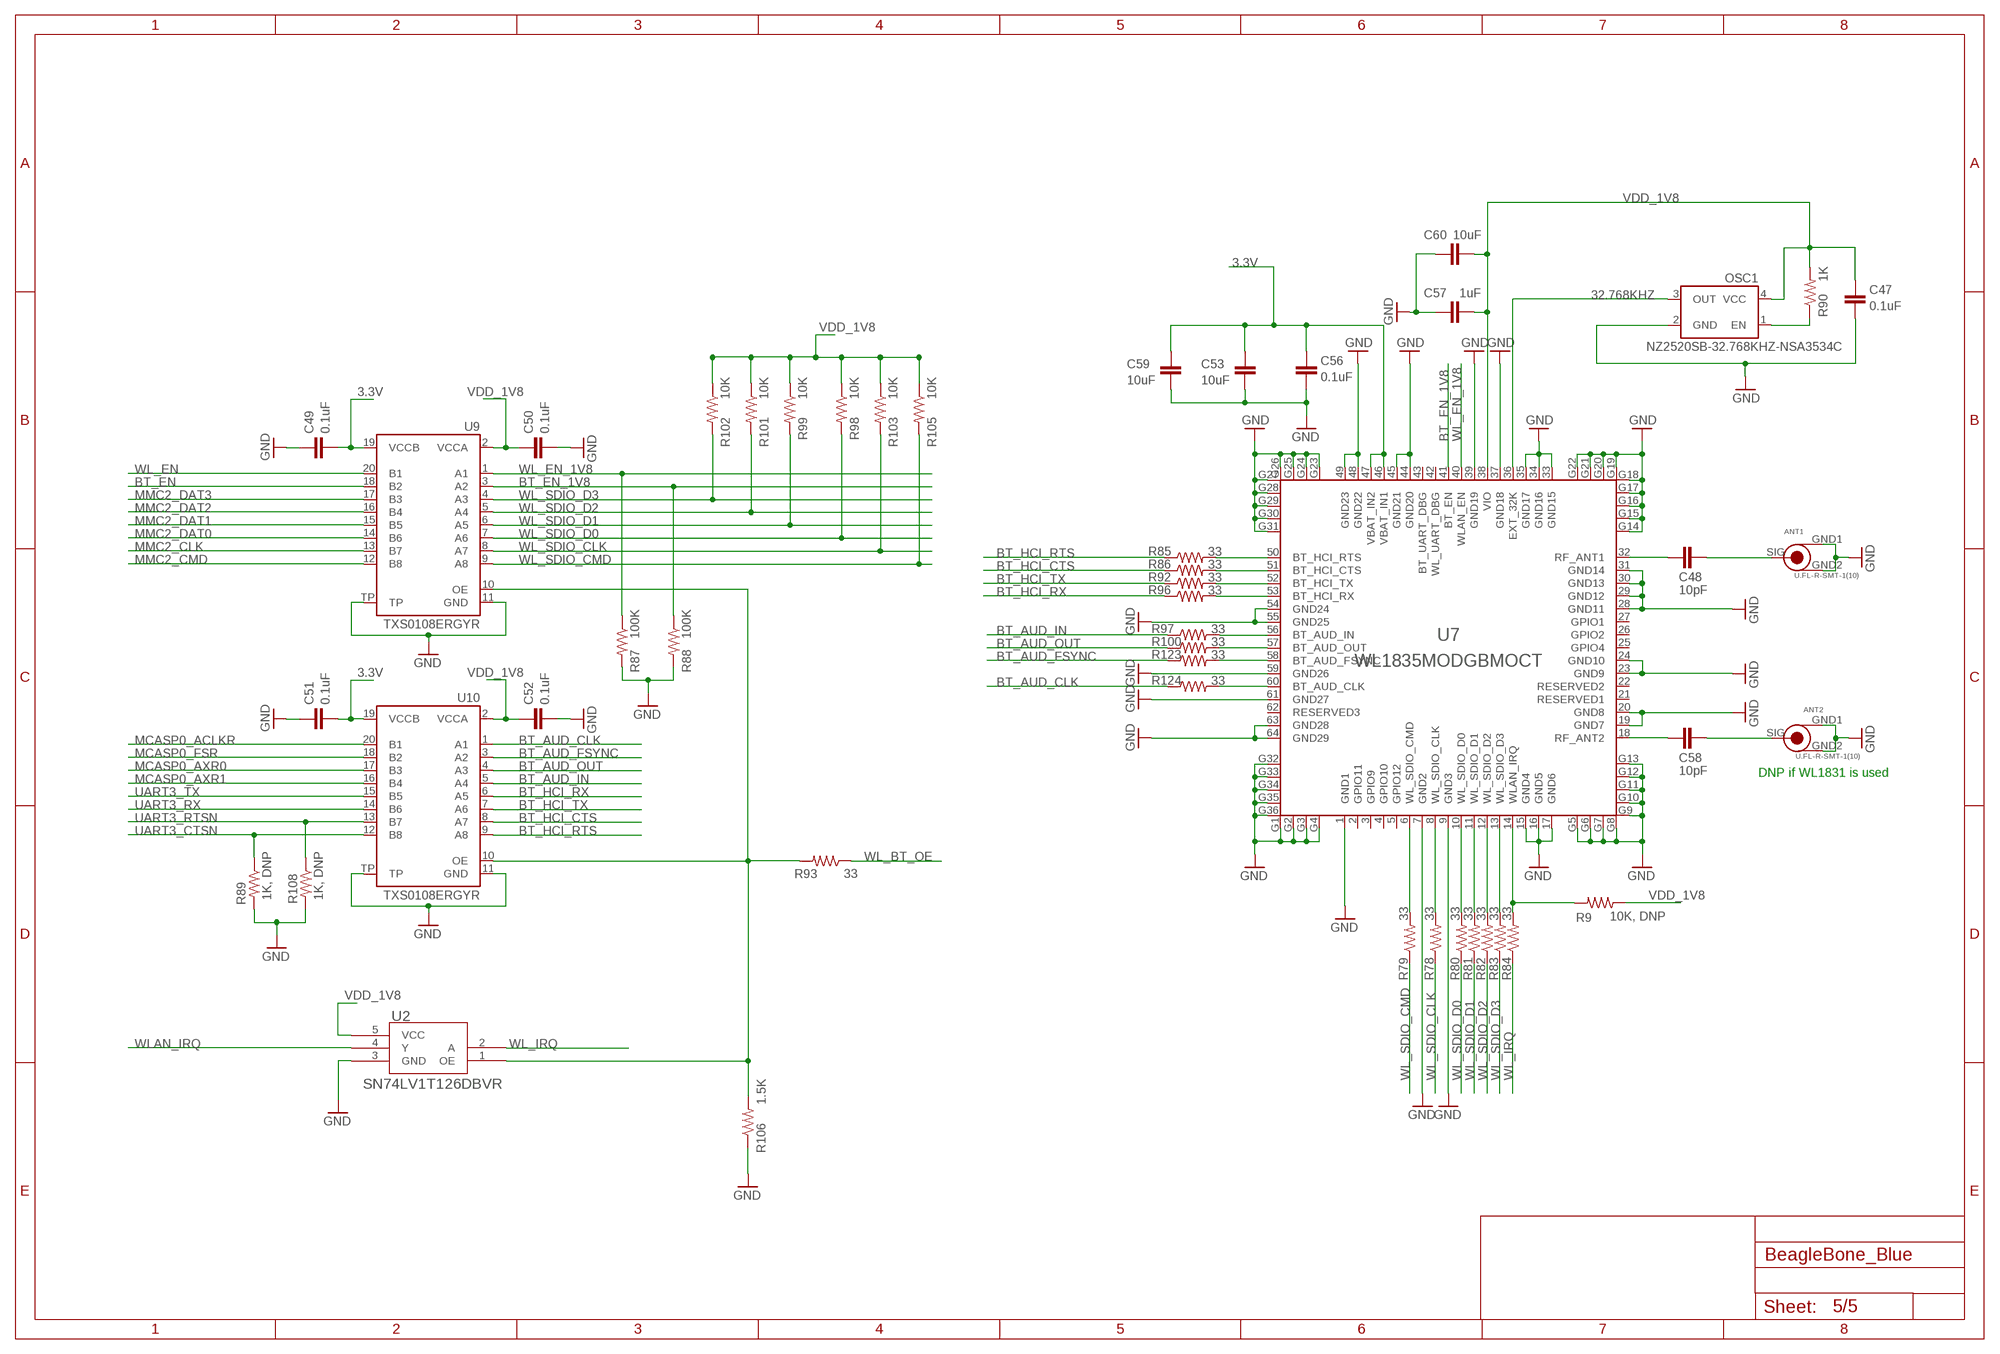
[diagram p4: schematic, sheet 5]

### Parts
ANT1  U.FL-R-SMT-1(10)  U.FL-R-SMT-1  [U.FL-R-SMT-1]
ANT2  U.FL-R-SMT-1(10)  U.FL-R-SMT-1  [U.FL-R-SMT-1]
C47  0.1uF  CAP0402-CAP  [0402-CAP]
C48  10pF  CAP0402-CAP  [0402-CAP]
C49  0.1uF  CAP0402-CAP  [0402-CAP]
C50  0.1uF  CAP0402-CAP  [0402-CAP]
C51  0.1uF  CAP0402-CAP  [0402-CAP]
C52  0.1uF  CAP0402-CAP  [0402-CAP]
C53  10uF  CAP0805  [0805]
C56  0.1uF  CAP0402-CAP  [0402-CAP]
C57  1uF  CAP0402-CAP  [0402-CAP]
C58  10pF  CAP0402-CAP  [0402-CAP]
C59  10uF  CAP0805  [0805]
C60  10uF  CAP0805  [0805]
OSC1  NZ2520SB-32.768KHZ-NSA3534C  OSCILLATOR  [NZ2520S]
R9  10K, DNP  RESISTOR0402-RES  [0402-RES]
R78  33  RESISTOR0402-RES  [0402-RES]
R79  33  RESISTOR0402-RES  [0402-RES]
R80  33  RESISTOR0402-RES  [0402-RES]
R81  33  RESISTOR0402-RES  [0402-RES]
R82  33  RESISTOR0402-RES  [0402-RES]
R83  33  RESISTOR0402-RES  [0402-RES]
R84  33  RESISTOR0402-RES  [0402-RES]
R85  33  RESISTOR0402-RES  [0402-RES]
R86  33  RESISTOR0402-RES  [0402-RES]
R87  100K  RESISTOR0402-RES  [0402-RES]
R88  100K  RESISTOR0402-RES  [0402-RES]
R89  1K, DNP  RESISTOR0402-RES  [0402-RES]
R90  1K  RESISTOR0402-RES  [0402-RES]
R92  33  RESISTOR0402-RES  [0402-RES]
R93  33  RESISTOR0402-RES  [0402-RES]
R96  33  RESISTOR0402-RES  [0402-RES]
R97  33  RESISTOR0402-RES  [0402-RES]
R98  10K  RESISTOR0402-RES  [0402-RES]
R99  10K  RESISTOR0402-RES  [0402-RES]
R100  33  RESISTOR0402-RES  [0402-RES]
R101  10K  RESISTOR0402-RES  [0402-RES]
R102  10K  RESISTOR0402-RES  [0402-RES]
R103  10K  RESISTOR0402-RES  [0402-RES]
R105  10K  RESISTOR0402-RES  [0402-RES]
R106  1.5K  RESISTOR0402-RES  [0402-RES]
R108  1K, DNP  RESISTOR0402-RES  [0402-RES]
R123  33  RESISTOR0402-RES  [0402-RES]
R124  33  RESISTOR0402-RES  [0402-RES]
U2  SN74LV1T126DBVR  [BEAGLEBONE_BLUE_SOT23-5]
U7  WL1835MODGBMOCT  WL1835MOD  [MOC-100(TI)]
U9  TXS0108ERGYR  [R-PVQFN-N20(TI)]
U10  TXS0108ERGYR  [R-PVQFN-N20(TI)]

### Nets
3.3V: C49.2 C51.2 C53.1 C56.1 C59.1 U7.46(VBAT_IN1) U7.47(VBAT_IN2) U9.19(VCCB) U10.19(VCCB) ; also sheet 1,2,3
32.768KHZ: OSC1.3(OUT) U7.36(EXT_32K)
ALT.BUFF.OE: R93.2 R106.2 U2.1(OE) U9.10(OE) U10.10(OE)
ANT1_A: C48.2 U7.32(RF_ANT1)
ANT1_B: ANT1.SIG C48.1
ANT2_A: C58.2 U7.18(RF_ANT2)
ANT2_B: ANT2.SIG C58.1
BT_AUD_CLK: R124.1 U10.1(A1)
BT_AUD_FSYNC: R123.1 U10.3(A2)
BT_AUD_IN: R97.1 U10.5(A4)
BT_AUD_OUT: R100.1 U10.4(A3)
BT_EN: U9.18(B2) ; also sheet 3
BT_EN_1V8: R88.1 U7.41(BT_EN) U9.3(A2)
BT_HCI_CTS: R86.1 U10.8(A7)
BT_HCI_RTS: R85.1 U10.9(A8)
BT_HCI_RX: R96.1 U10.6(A5)
BT_HCI_TX: R92.1 U10.7(A6)
GND [ground]: ANT1.GND1 ANT1.GND2 ANT2.GND1 ANT2.GND2 C47.2 C49.1 C50.2 C51.1 C52.2 C53.2 C56.2 C57.1 C59.2 C60.1 OSC1.2(GND) R87.2 R88.2 R89.2 R106.1 R108.2 U2.3(GND) U7.1(GND1) U7.7(GND2) U7.9(GND3) U7.15(GND4) U7.16(GND5) U7.17(GND6) U7.19(GND7) U7.20(GND8) U7.23(GND9) U7.24(GND10) U7.28(GND11) U7.29(GND12) U7.30(GND13) U7.31(GND14) U7.33(GND15) U7.34(GND16) U7.35(GND17) U7.37(GND18) U7.39(GND19) U7.44(GND20) U7.45(GND21) U7.48(GND22) U7.49(GND23) U7.54(GND24) U7.55(GND25) U7.59(GND26) U7.61(GND27) U7.63(GND28) U7.64(GND29) U7.G1 U7.G2 U7.G3 U7.G4 U7.G5 U7.G6 U7.G7 U7.G8 U7.G9 U7.G10 U7.G11 U7.G12 U7.G13 U7.G14 U7.G15 U7.G16 U7.G17 U7.G18 U7.G19 U7.G20 U7.G21 U7.G22 U7.G23 U7.G24 U7.G25 U7.G26 U7.G27 U7.G28 U7.G29 U7.G30 U7.G31 U7.G32 U7.G33 U7.G34 U7.G35 U7.G36 U9.11(GND) U9.TP U10.11(GND) U10.TP ; also sheet 1,2,3,4
MCASP0_ACLKR: U10.20(B1) ; also sheet 2
MCASP0_AXR0: U10.17(B3) ; also sheet 3
MCASP0_AXR1: U10.16(B4) ; also sheet 3
MCASP0_FSR: U10.18(B2) ; also sheet 2
MMC2_CLK: U9.13(B7) ; also sheet 3
MMC2_CMD: U9.12(B8) ; also sheet 3
MMC2_DAT0: U9.14(B6) ; also sheet 3
MMC2_DAT1: U9.15(B5) ; also sheet 3
MMC2_DAT2: U9.16(B4) ; also sheet 3
MMC2_DAT3: U9.17(B3) ; also sheet 3
N$7: OSC1.1(EN) R90.1
N$43: R100.2 U7.57(BT_AUD_OUT)
N$103: R9.2 R84.2 U7.14(WLAN_IRQ)
N$104: R83.2 U7.13(WL_SDIO_D3)
N$105: R82.2 U7.12(WL_SDIO_D2)
N$106: R81.2 U7.11(WL_SDIO_D1)
N$107: R80.2 U7.10(WL_SDIO_D0)
N$108: R78.2 U7.8(WL_SDIO_CLK)
N$111: R79.2 U7.6(WL_SDIO_CMD)
N$112: R85.2 U7.50(BT_HCI_RTS)
N$113: R86.2 U7.51(BT_HCI_CTS)
N$114: R92.2 U7.52(BT_HCI_TX)
N$116: R96.2 U7.53(BT_HCI_RX)
N$146: R97.2 U7.56(BT_AUD_IN)
N$148: R123.2 U7.58(BT_AUD_FSYNC)
N$149: R124.2 U7.60(BT_AUD_CLK)
UART3_CTSN: R89.1 U10.12(B8) ; also sheet 3
UART3_RTSN: R108.1 U10.13(B7) ; also sheet 3
UART3_RX: U10.14(B6) ; also sheet 3
UART3_TX: U10.15(B5) ; also sheet 3
VDD_1V8: C47.1 C50.1 C52.1 C57.2 C60.2 OSC1.4(VCC) R9.1 R90.2 R98.1 R99.1 R101.1 R102.1 R103.1 R105.1 U2.5(VCC) U7.38(VIO) U9.2(VCCA) U10.2(VCCA) ; also sheet 2,4
WL_BT_OE: R93.1 ; also sheet 3
WL_EN: U9.20(B1) ; also sheet 3
WL_EN_1V8: R87.1 U7.40(WLAN_EN) U9.1(A1)
WL_IRQ: R84.1 U2.2(A)
WL_SDIO_CLK: R78.1 R103.2 U9.8(A7)
WL_SDIO_CMD: R79.1 R105.2 U9.9(A8)
WL_SDIO_D0: R80.1 R98.2 U9.7(A6)
WL_SDIO_D1: R81.1 R99.2 U9.6(A5)
WL_SDIO_D2: R82.1 R101.2 U9.5(A4)
WL_SDIO_D3: R83.1 R102.2 U9.4(A3)
WLAN_IRQ: U2.4(Y) ; also sheet 3
Unconnected: U7.2(GPIO11) U7.3(GPIO9) U7.4(GPIO10) U7.5(GPIO12) U7.21(RESERVED1) U7.22(RESERVED2) U7.25(GPIO4) U7.26(GPIO2) U7.27(GPIO1) U7.42(WL_UART_DBG) U7.43(BT_UART_DBG) U7.62(RESERVED3)

### Notes on the sheet
- DNP if WL1831 is used

## Power pins joined to a net without a drawn wire
VIN_BAT_0: SIP.Y2(A:VIN_BAT_0)
VIN_BAT_1: SIP.Y3(A:VIN_BAT_1)

## Library data of the parts
0 1-3 G ON R WIFI = BeagleBone_Blue:LED: LEDs Standard schematic elements and footprints for 5mm, 3mm, 1206, and 0603 sized LEDs. 5mm - Spark Fun Electronics SKU : COM-00529 (and others)
5VREG = BeagleBone_Blue:AP1509: 150KHz, 2A PWM BUCK DC/DC CONVERTER
6VREG = Strawson_Eagle_Lib:AOZ1284
12V = GHI:PJ-102B_POWER_CON
ADC GP0 GP1 GPS S1.1 S1.2 = Strawson_Eagle_Lib:JST_SH_6
ANT1 ANT2 = GHI-Connectors:U.FL-R-SMT-1
B0 B1-B3 CHG = SparkFun-LED:LED: LEDs Standard schematic elements and footprints for 5mm, 3mm, 1206, and 0603 sized LEDs. 5mm - Spark Fun Electronics SKU : COM-00529 (and others)
BAL = Strawson_Eagle_Lib:BQ29209: BQ29209 2-CELL Balance and Overvoltage Protection
BMP = Strawson_Eagle_Lib:BMP280: BOSCH BMP280 Digital Pressure Sensor
C1 C2 C4 C6 C8-C10 C13-C15 C17-C19 C21 C22 C24 C27-C52 C54-C58 C61-C63 = Strawson_Eagle_Lib:CAP: Capacitor Standard 0603 ceramic capacitor, and 0.1" leaded capacitor.
C3 C5 C7 C12 C16 C20 C23 C25 C26 C53 C59 C60 = SparkFun-Capacitors:CAP: Capacitor Standard 0603 ceramic capacitor, and 0.1" leaded capacitor.
C11 = adafruit:CPOL-US: POLARIZED CAPACITOR, American symbol
CAN E1-E4 I2C PWR UT0 UT1 UT5 = Strawson_Eagle_Lib:JST_SH_4
CHGIC = Strawson_Eagle_Lib:MP2615
D1-D3 = BeagleBone_Blue:DIODE: Diode
D9 = Strawson_Eagle_Lib:DIODE: Diode
DSM2 = Strawson_Eagle_Lib:JST_ZH_3
EMU0 EMU1 TCK TDI TDO TMS TP1 TP12 TRSTN = testpad:TPSQ: Test pad
FUD1-FUD6 = GHI:FIDUCIAL
GND WP = BeagleBone_Blue:GHI2_TESTPAD/W_HOLE_1X1
H1 H2 = SparkFun:TB6621FNG: Toshiba 1A motor driver
IMU = Strawson_Eagle_Lib:MPU-9250: 314990005; MPN: MPU-9250
J2 = BeagleBone_Blue:STRAWSON_EAGLE_LIB_SERVO_HEADERS_8X
L1 L2 = SparkFun-Passives:INDUCTOR: Inductors; PROD_ID: NDUC-11627; VALUE: 33uH
L3 = Strawson_Eagle_Lib:INDUCTOR: Inductors; VALUE: 3.3uH
L4 L5 = Seeed-OPL-Inductor:INDUCTOR/FERRITE-BEAD
LIPO = Strawson_Eagle_Lib:JST_XH_3-PIN
M1-M4 = Strawson_Eagle_Lib:JST_ZH_2
MGT1-MGT4 = BeagleBoneBlack:MOUNTING_HOLE: Chassis Mounting Hole w/GND connection ability
MOD PAU POW RST SD = SparkFun-Electromechanical:SWITCH-MOMENTARY-2: Various NO switches- pushbuttons, reed, etc; PROD_ID: SWCH-00815
OSC1 = GHI-IC:OSCILLATOR
PROT = Strawson_Eagle_Lib:S-8261
Q1 = Strawson_Eagle_Lib:MOSFET-NCHANNEL: Common NMOSFET Parts MFG P/N Store ID Prod ID FDD8780 TRANS-09984 SI7820DN TRANS-11055 FDS6630A IC-08089 2N7002PW TRANS-11151 FQP30N06L COM-10213 TRANS-10060 BSS123LT1G TRANS-08345 BSS138 TRANS-00830 BS170 2N7000
R1-R3 R5-R103 R105 R106 R108-R111 R113 R115 R116 R118 R120 R122-R125 R127 R129 R131 R135 R140 R143 R149 R150 R156 R158 = Strawson_Eagle_Lib:RESISTOR: Resistor Basic schematic elements and footprints for 0603, 1206, and PTH resistors.
R4 R104 R112 R119 R121 = SparkFun-Resistors:RESISTOR: Resistor Basic schematic elements and footprints for 0603, 1206, and PTH resistors.
R107 = rcl:R-US_: RESISTOR, American symbol
SIP = BeagleBone_Blue:OSD3358: Octavo Systems LLC - OSD3358 Rev A
TP5 = BeagleBone_Blue:TP: Test pad
U1 = BeagleBone_Blue:TCAN1051HV; DATASHEETURL: http://www.ti.com/lit/ds/symlink/tcan1051hv.pdf; DESCRIPTION: CAN Transceiver; FAMILY_NAME: CAN Transceiver; GENERIC_PART_NUMBER: TCAN1051HV; INDUSTRY_STD_PKG_TYPE: SOIC; MANUFACTURER: Texas Instruments; MANUFACTURER_PART_NUMBER: TCAN1051HVD; PACKAGE_DESIGNATOR: D; PIN_COUNT: 8; VENDOR: Texas Instruments
U2 = BeagleBone_Blue:SN74LV1T126DBVR
U3 U4 = GHI-IC:TPD4S012DRYR
U5 = Microchip-24LCxxx:24LC_: IC, I2C Serial EEPROM,SOT-23-5; MPN: 24LC32AT-I/OT; OC_FARNELL: 1700993; OC_NEWARK: 08P0113; PACKAGE: SOT-23-5; SUPPLIER: MICROCHIP
U6 = BeagleBone_Blue:SN74LVC1G07_DCK_5; DATASHEETURL: http://www.ti.com/lit/gpn/SN74LVC1G07; DESCRIPTION: Single Buffer/Driver With Open-Drain Output; FAMILY_NAME: LL BUFFER AND DRIVER WITH OPEN-DRAIN OUTPUT; GENERIC_PART_NUMBER: SN74LVC1G07; INDUSTRY_STD_PKG_TYPE: SC70; MANUFACTURER: Texas Instruments; MANUFACTURER_PART_NUMBER: sn74lvc1g07_dck_5; PACKAGE_DESIGNATOR: DCK; PIN_COUNT: 5; VENDOR: Texas Instruments
U7 = GHI-IC:WL1835MOD
U8 = BeagleBone_Blue:TPS2105_DBV_5; DATASHEETURL: http://www.ti.com/lit/gpn/TPS2105; DESCRIPTION: 2.7-5.5V Dual In/Single Out MOSFET, 0.5A Main/0.1A Aux Input, Act-High Enable, Industrial Temp.; FAMILY_NAME: POWER MULTIPLEXER (MUX); GENERIC_PART_NUMBER: TPS2105; INDUSTRY_STD_PKG_TYPE: SOT-23; MANUFACTURER: Texas Instruments; MANUFACTURER_PART_NUMBER: tps2105_dbv_5; PACKAGE_DESIGNATOR: DBV; PIN_COUNT: 5; VENDOR: Texas Instruments
U9 U10 = GHI-IC:TXS0108ERGYR
U13 = GHI-IC:EMMC04G-S100-B08U
X2 = GHI-Connectors:SCHA5B0200(ALPS_USD)
X3 = GHI2:USB_HOST_W/CHASSIS_GND
X4 = GHI-Connectors:10118192-0001LF: Amphenol FCI Micro USB Type B Complete Surface Mount (SMT) no guide holes
Y1 = GHI2:CRYSTAL_5X3.2MM
Y2 = GHI2:CRYSTAL_3.2X1.5

## Net classes
0 default: width 0.152 mm, drill 0.254 mm, clearance 0.152 mm
1 ground: width 0.152 mm, drill 0.254 mm, clearance 0.152 mm
2 usb: width 0.152 mm, drill 0.254 mm, clearance 0.152 mm
3 power: width 0.152 mm, drill 0.254 mm, clearance 0.152 mm